# Altium project PC110.PrjPcb (part 4 of 5)

## Sheet Super_IO.SchDoc
size 420 x 297 mm
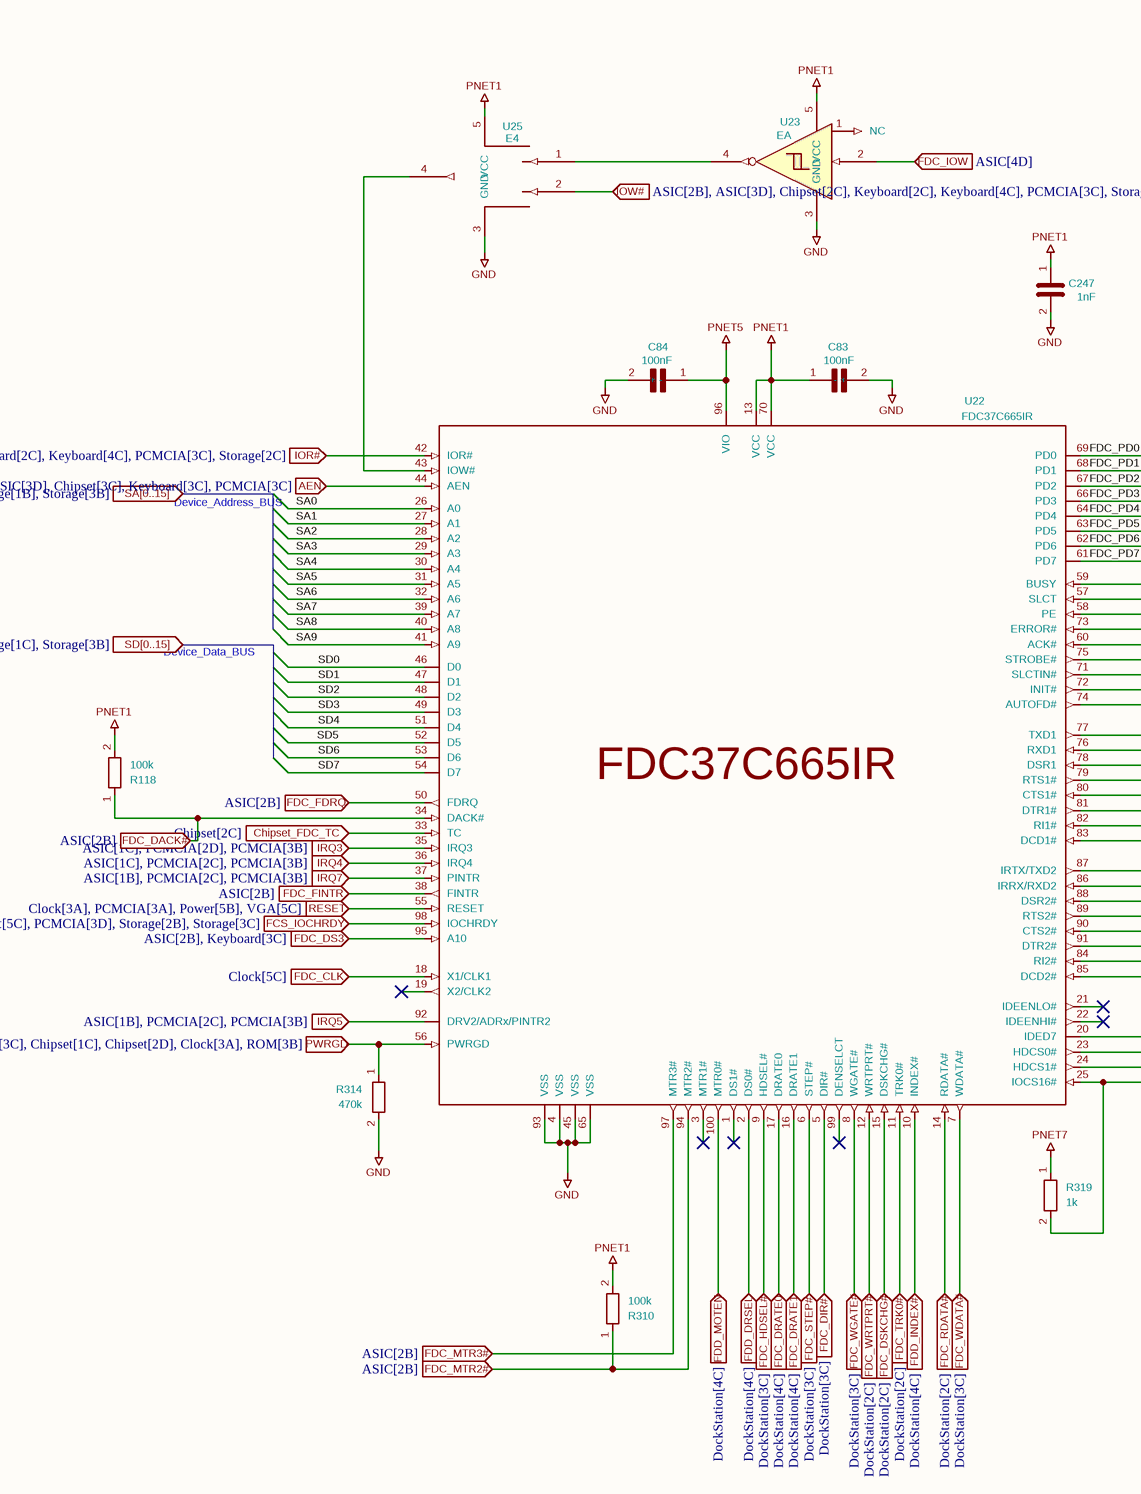
[diagram p32: Super_IO.SchDoc, left]
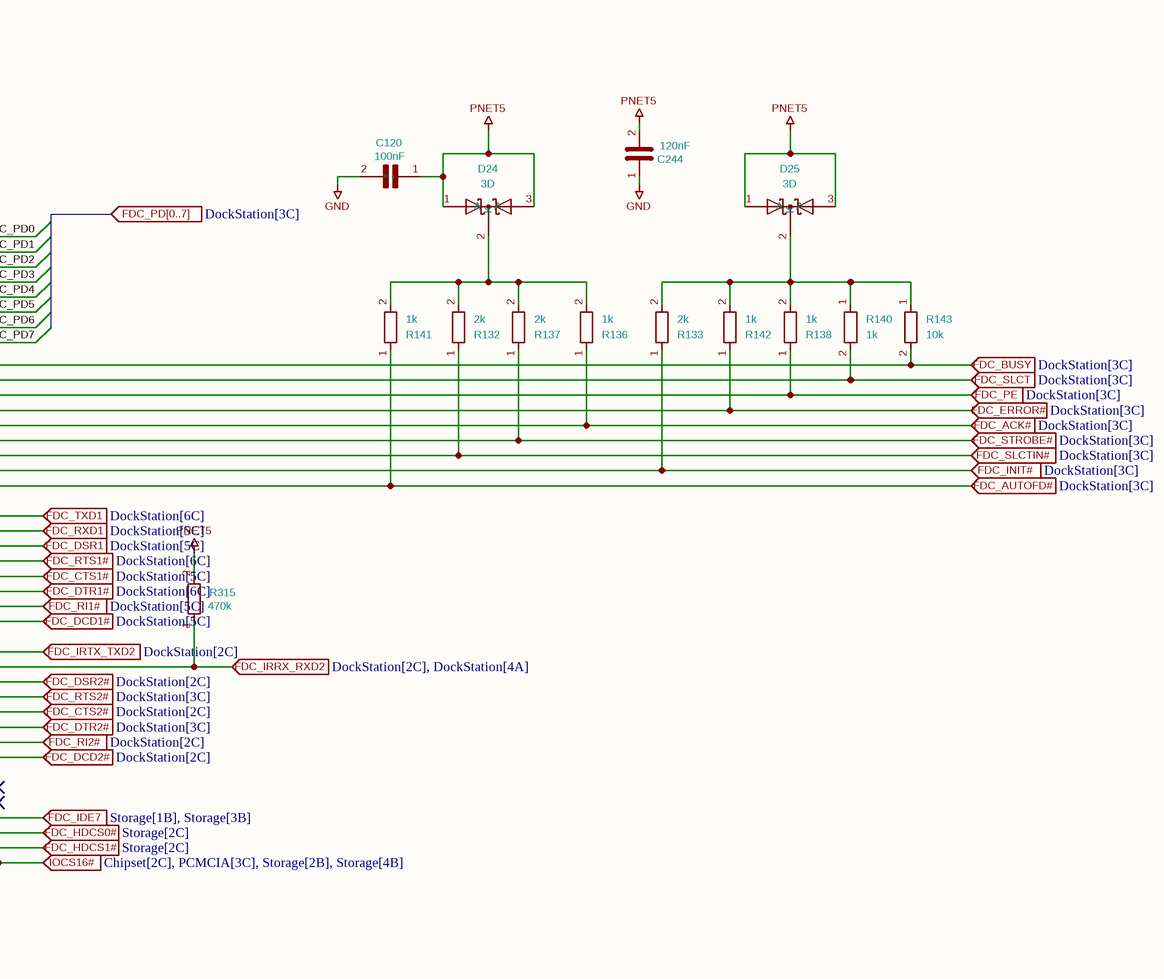
[diagram p33: Super_IO.SchDoc, right]

### Parts
C83  100nF  [C_0402_1005Metric]
C84  100nF  [C_0402_1005Metric]
C120  100nF  [C_0402_1005Metric]
C244  120nF  [C_0402_1005Metric]
C247  1nF  [C_0402_1005Metric]
D24  3D  [3D]
D25  3D  [3D]
R118  100k  [R_0402_1005Metric]
R132  2k  [R_0402_1005Metric]
R133  2k  [R_0402_1005Metric]
R136  1k  [R_0402_1005Metric]
R137  2k  [R_0402_1005Metric]
R138  1k  [R_0402_1005Metric]
R140  1k  [R_0402_1005Metric]
R141  1k  [R_0402_1005Metric]
R142  1k  [R_0402_1005Metric]
R143  10k  [R_0402_1005Metric]
R310  100k  [R_0402_1005Metric]
R314  470k  [R_0402_1005Metric]
R315  470k  [R_0402_1005Metric]
R319  1k  [R_0402_1005Metric]
U22  FDC37C665IR  [FDC]
U23  EA  [SOT-353]
U25  E4  [SOT-353]

### Ports
AEN (in, see ASIC[2B], ASIC[3D], Chipset[3C], Keyboard[3C], PCMCIA[3C]), Chipset_FDC_TC (in, see Chipset[2C]), FCS_IOCHRDY (in, see Chipset[5C], PCMCIA[3D], Storage[2B], Storage[3C]), FDC_ACK# (in, see DockStation[3C]), FDC_AUTOFD# (in, see DockStation[3C]), FDC_BUSY (in, see DockStation[3C]), FDC_CLK (in, see Clock[5C]), FDC_CTS1# (in, see DockStation[5C]), FDC_CTS2# (in, see DockStation[2C]), FDC_DACK# (in, see ASIC[2B]), FDC_DCD1# (in, see DockStation[5C]), FDC_DCD2# (in, see DockStation[2C]), FDC_DIR# (in, see DockStation[3C]), FDC_DRATE0 (in, see DockStation[4C]), FDC_DRATE1 (in, see DockStation[4C]), FDC_DS3 (in, see ASIC[2B], Keyboard[3C]), FDC_DSKCHG# (in, see DockStation[2C]), FDC_DSR1 (in, see DockStation[5C]), FDC_DSR2# (in, see DockStation[2C]), FDC_DTR1# (in, see DockStation[6C]), FDC_DTR2# (in, see DockStation[3C]), FDC_ERROR# (in, see DockStation[3C]), FDC_FDRQ (in, see ASIC[2B]), FDC_FINTR (in, see ASIC[2B]), FDC_HDCS0# (in, see Storage[2C]), FDC_HDCS1# (in, see Storage[2C]), FDC_HDSEL# (in, see DockStation[3C]), FDC_IDE7 (in, see Storage[1B], Storage[3B]), FDC_INIT# (in, see DockStation[3C]), FDC_IOW (in, see ASIC[4D]), FDC_IRRX_RXD2 (in, see DockStation[2C], DockStation[4A]), FDC_IRTX_TXD2 (in, see DockStation[2C]), FDC_MTR2# (in, see ASIC[2B]), FDC_MTR3# (in, see ASIC[2B]), FDC_PD[0..7] (in, see DockStation[3C]), FDC_PE (in, see DockStation[3C]), FDC_RDATA# (in, see DockStation[2C]), FDC_RI1# (in, see DockStation[5C]), FDC_RI2# (in, see DockStation[2C]), FDC_RTS1# (in, see DockStation[6C]), FDC_RTS2# (in, see DockStation[3C]), FDC_RXD1 (in, see DockStation[5C]), FDC_SLCT (in, see DockStation[3C]), FDC_SLCTIN# (in, see DockStation[3C]), FDC_STEP# (in, see DockStation[3C]), FDC_STROBE# (in, see DockStation[3C]), FDC_TRK0# (in, see DockStation[2C]), FDC_TXD1 (in, see DockStation[6C]), FDC_WDATA# (in, see DockStation[3C]), FDC_WGATE# (in, see DockStation[3C]), FDC_WRTPRT# (in, see DockStation[2C]), FDD_DRSEL (in, see DockStation[4C]), FDD_INDEX# (in, see DockStation[4C]), FDD_MOTEN (in, see DockStation[4C]), IOCS16# (in, see Chipset[2C], PCMCIA[3C], Storage[2B], Storage[4B]), IOR# (in, see ASIC[2B], ASIC[3D], Audio[3C], Audio[4C], Chipset[2C], Keyboard[2C], Keyboard[4C], PCMCIA[3C], Storage[2C]), IOW# (in, see ASIC[2B], ASIC[3D], Chipset[2C], Keyboard[2C], Keyboard[4C], PCMCIA[3C], Storage[2C]), IRQ3 (in, see ASIC[1C], PCMCIA[2D], PCMCIA[3B]), IRQ4 (in, see ASIC[1C], PCMCIA[2C], PCMCIA[3B]), IRQ5 (in, see ASIC[1B], PCMCIA[2C], PCMCIA[3B]), IRQ7 (in, see ASIC[1B], PCMCIA[2C], PCMCIA[3B]), PWRGD (in, see ASIC[2B], ASIC[3B], ASIC[3C], Chipset[1C], Chipset[2D], Clock[3A], ROM[3B]), RESET (in, see Clock[3A], PCMCIA[3A], Power[5B], VGA[5C]), SA[0..15] (in, see ASIC[1B], ASIC[3D], Audio[4B], Chipset[2D], Chipset[6B], Keyboard[1C], PCMCIA[2B], ROM[1B], ROM[3B], Storage[1B], Storage[3B]), SD[0..15] (in, see ASIC[1B], ASIC[3C], Audio[3B], Chipset[2B], Keyboard[1C], PCMCIA[2C], ROM[3B], ROM[5C], Storage[1B], Storage[1C], Storage[3B])

### Nets
GND: C83.2(-) C84.2(-) C120.2(-) C244.1 C247.2 R314.2 U22.4(VSS) U22.45(VSS) U22.65(VSS) U22.93(VSS) U23.3(GND) U25.3(GND)
PNET1: C83.1(+) C247.1 R118.2 R310.2 U22.13(VCC) U22.70(VCC) U23.5(VCC) U25.5(VCC)
PNET5: C84.1(+) C120.1(+) C244.2 D24.1(A) D24.3(A) D25.1(A) D25.3(A) R315.2 U22.96(VIO)
PNET7: R319.1
AEN: U22.44(AEN) ; port AEN
Chipset_FDC_TC: U22.33(TC) ; port Chipset_FDC_TC
FCS_IOCHRDY: U22.98(IOCHRDY) ; port FCS_IOCHRDY
FDC_ACK#: R136.1 U22.60(ACK#) ; port FDC_ACK#
FDC_AUTOFD#: R141.1 U22.74(AUTOFD#) ; port FDC_AUTOFD#
FDC_BUSY: R143.2 U22.59(BUSY) ; port FDC_BUSY
FDC_CLK: U22.18(X1/CLK1) ; port FDC_CLK
FDC_CTS1#: U22.80(CTS1#) ; port FDC_CTS1#
FDC_CTS2#: U22.90(CTS2#) ; port FDC_CTS2#
FDC_DACK#: R118.1 U22.34(DACK#) ; port FDC_DACK#
FDC_DCD1#: U22.83(DCD1#) ; port FDC_DCD1#
FDC_DCD2#: U22.85(DCD2#) ; port FDC_DCD2#
FDC_DIR#: U22.5(DIR#) ; port FDC_DIR#
FDC_DRATE0: U22.17(DRATE0) ; port FDC_DRATE0
FDC_DRATE1: U22.16(DRATE1) ; port FDC_DRATE1
FDC_DS3: U22.95(A10) ; port FDC_DS3
FDC_DSKCHG#: U22.15(DSKCHG#) ; port FDC_DSKCHG#
FDC_DSR1: U22.78(DSR1) ; port FDC_DSR1
FDC_DSR2#: U22.88(DSR2#) ; port FDC_DSR2#
FDC_DTR1#: U22.81(DTR1#) ; port FDC_DTR1#
FDC_DTR2#: U22.91(DTR2#) ; port FDC_DTR2#
FDC_ERROR#: R142.1 U22.73(ERROR#) ; port FDC_ERROR#
FDC_FDRQ: U22.50(FDRQ) ; port FDC_FDRQ
FDC_FINTR: U22.38(FINTR) ; port FDC_FINTR
FDC_HDCS0#: U22.23(HDCS0#) ; port FDC_HDCS0#
FDC_HDCS1#: U22.24(HDCS1#) ; port FDC_HDCS1#
FDC_HDSEL#: U22.9(HDSEL#) ; port FDC_HDSEL#
FDC_IDE7: U22.20(IDED7) ; port FDC_IDE7
FDC_INIT#: R133.1 U22.72(INIT#) ; port FDC_INIT#
FDC_IOW: U23.2 ; port FDC_IOW
FDC_IRRX_RXD2: R315.1 U22.86(IRRX/RXD2) ; port FDC_IRRX_RXD2
FDC_IRTX_TXD2: U22.87(IRTX/TXD2) ; port FDC_IRTX_TXD2
FDC_MTR2#: R310.1 U22.94(MTR2#) ; port FDC_MTR2#
FDC_MTR3#: U22.97(MTR3#) ; port FDC_MTR3#
FDC_PD0: U22.69(PD0)
FDC_PD1: U22.68(PD1)
FDC_PD2: U22.67(PD2)
FDC_PD3: U22.66(PD3)
FDC_PD4: U22.64(PD4)
FDC_PD5: U22.63(PD5)
FDC_PD6: U22.62(PD6)
FDC_PD7: U22.61(PD7)
FDC_PE: R138.1 U22.58(PE) ; port FDC_PE
FDC_RDATA#: U22.14(RDATA#) ; port FDC_RDATA#
FDC_RI1#: U22.82(RI1#) ; port FDC_RI1#
FDC_RI2#: U22.84(RI2#) ; port FDC_RI2#
FDC_RTS1#: U22.79(RTS1#) ; port FDC_RTS1#
FDC_RTS2#: U22.89(RTS2#) ; port FDC_RTS2#
FDC_RXD1: U22.76(RXD1) ; port FDC_RXD1
FDC_SLCT: R140.2 U22.57(SLCT) ; port FDC_SLCT
FDC_SLCTIN#: R132.1 U22.71(SLCTIN#) ; port FDC_SLCTIN#
FDC_STEP#: U22.6(STEP#) ; port FDC_STEP#
FDC_STROBE#: R137.1 U22.75(STROBE#) ; port FDC_STROBE#
FDC_TRK0#: U22.11(TRK0#) ; port FDC_TRK0#
FDC_TXD1: U22.77(TXD1) ; port FDC_TXD1
FDC_WDATA#: U22.7(WDATA#) ; port FDC_WDATA#
FDC_WGATE#: U22.8(WGATE#) ; port FDC_WGATE#
FDC_WRTPRT#: U22.12(WRTPRT#) ; port FDC_WRTPRT#
FDD_DRSEL: U22.2(DS0#) ; port FDD_DRSEL
FDD_INDEX#: U22.10(INDEX#) ; port FDD_INDEX#
FDD_MOTEN: U22.100(MTR0#) ; port FDD_MOTEN
IOCS16#: R319.2 U22.25(IOCS16#) ; port IOCS16#
IOR#: U22.42(IOR#) ; port IOR#
IOW#: U25.2 ; port IOW#
IRQ3: U22.35(IRQ3) ; port IRQ3
IRQ4: U22.36(IRQ4) ; port IRQ4
IRQ5: U22.92(DRV2/ADRx/PINTR2) ; port IRQ5
IRQ7: U22.37(PINTR) ; port IRQ7
PWRGD: R314.1 U22.56(PWRGD) ; port PWRGD
RESET: U22.55(RESET) ; port RESET
SA0: U22.26(A0)
SA1: U22.27(A1)
SA2: U22.28(A2)
SA3: U22.29(A3)
SA4: U22.30(A4)
SA5: U22.31(A5)
SA6: U22.32(A6)
SA7: U22.39(A7)
SA8: U22.40(A8)
SA9: U22.41(A9)
SD0: U22.46(D0)
SD1: U22.47(D1)
SD2: U22.48(D2)
SD3: U22.49(D3)
SD4: U22.51(D4)
SD5: U22.52(D5)
SD6: U22.53(D6)
SD7: U22.54(D7)
NetD24_2: D24.2(K) R132.2 R136.2 R137.2 R141.2
NetD25_2: D25.2(K) R133.2 R138.2 R140.1 R142.2 R143.1
NetU22_43: U22.43(IOW#) U25.4
NetU23_4: U23.4 U25.1

Not connected (* = marked no-connect by the designer): U22 1(DS1#)* 3(MTR1#)* 19(X2/CLK2)* 21(IDEENLO#)* 22(IDEENHI#)* 99(DENSELCT)*; U23 1(NC)

### Notes on the sheet
- Device_Address_BUS
- Device_Data_BUS
- 1
- 2
- 3
- 4
- 5
- 6
- 7
- 8
- A
- B
- C
- D
- E
- Title: PC110
- File: Super_IO.kicad_sch
- Sheet: /
- Recreated by: Ahmad Byagowi
- F
- KiCad E.D.A.  kicad (5.1.4)-1
- Size: A3
- Date:
- Rev:
- Id: 1/1

### Library data of the parts
C83 C84 C120 C244 C247 = C: Footprint: Capacitor_SMD:C_0402_1005Metric
  C83 C84 C120: Value: 100nF
  C244: Value: 120nF
  C247: Value: 1nF
D24 D25 = D_Schottky_Dual_CommonCathode_AKA: Value: 3D; Footprint: PC110:3D
R118 R132 R133 R136-R138 R140-R143 R310 R314 R315 R319 = R
  R118: Value: 100k; Footprint: PCM_Resistor_SMD_AKL:R_0402_1005Metric
  R132 R133 R137: Value: 2k; Footprint: PCM_Resistor_SMD_AKL:R_0402_1005Metric
  R136 R138 R140-R142 R319: Value: 1k; Footprint: PCM_Resistor_SMD_AKL:R_0402_1005Metric
  R143: Value: 10k; Footprint: PCM_Resistor_SMD_AKL:R_0402_1005Metric
  R310: Value: 100k; Footprint: Resistor_SMD:R_0402_1005Metric
  R314: Value: 470k; Footprint: PCM_Resistor_SMD_AKL:R_0402_1005Metric
  R315: Value: 470k; Footprint: Resistor_SMD:R_0402_1005Metric
U23 = 74AHC1G14: Value: EA; Footprint: PC110:SOT-353
U25 = 74AHC1G32: Value: E4; Footprint: PC110:SOT-353
U22 = FDC37C665IR: Value: FDC37C665IR; Footprint: PC110:FDC

## Sheet Storage.SchDoc
size 594 x 420 mm
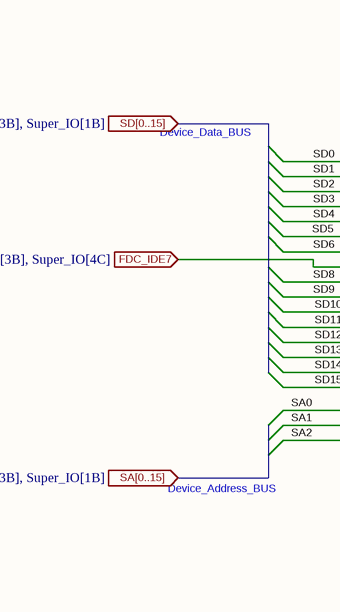
[diagram p34: Storage.SchDoc, top left]
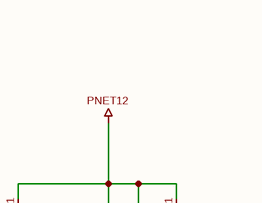
[diagram p35: Storage.SchDoc, top middle]
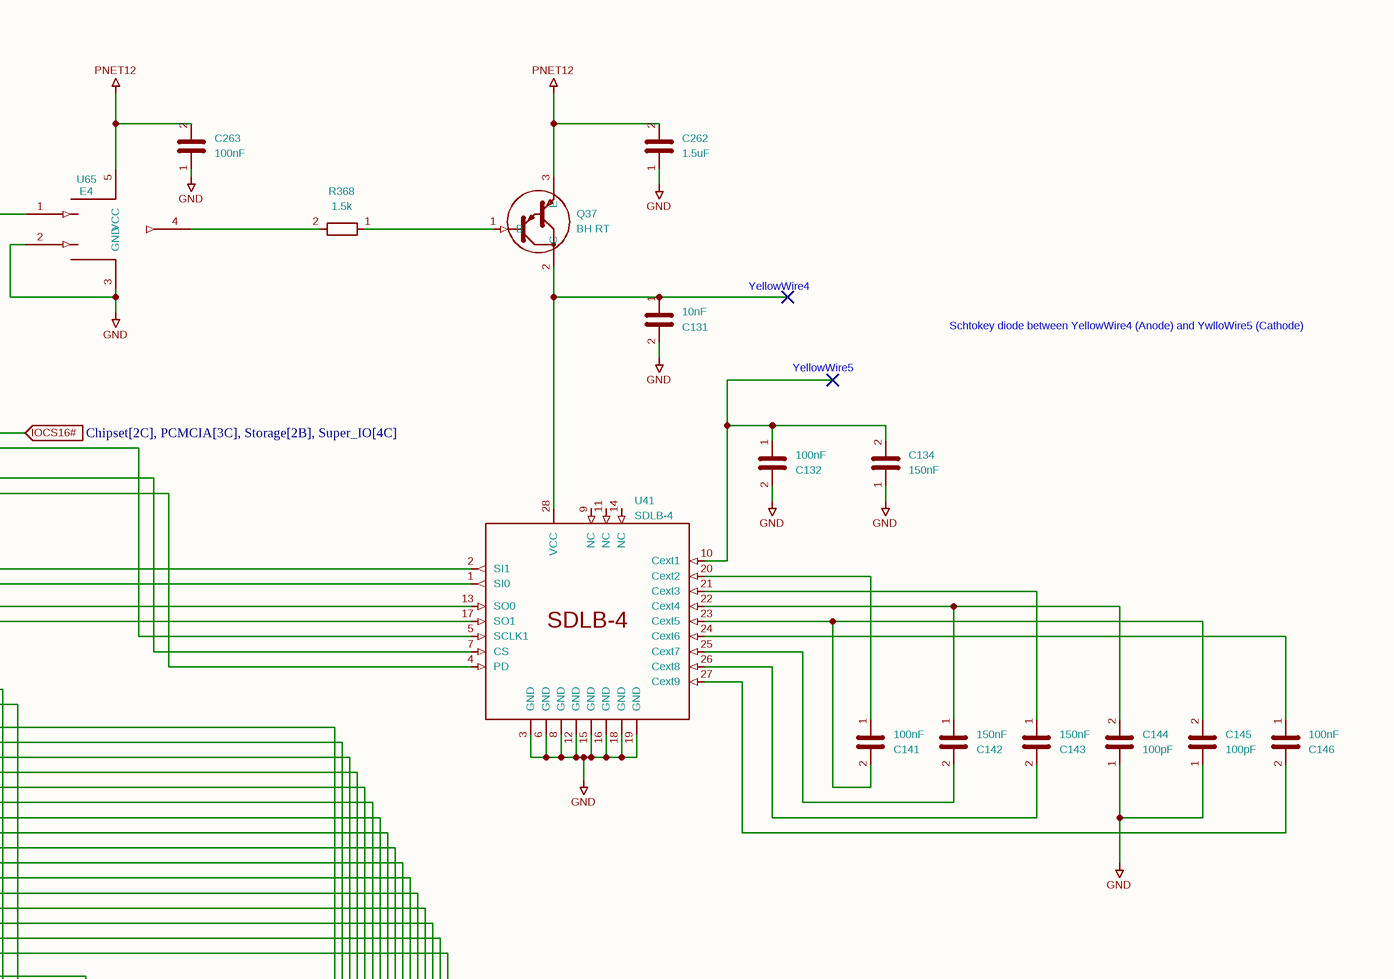
[diagram p36: Storage.SchDoc, top right]
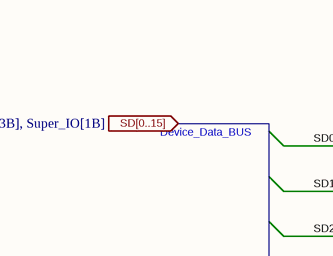
[diagram p37: Storage.SchDoc, bottom left]
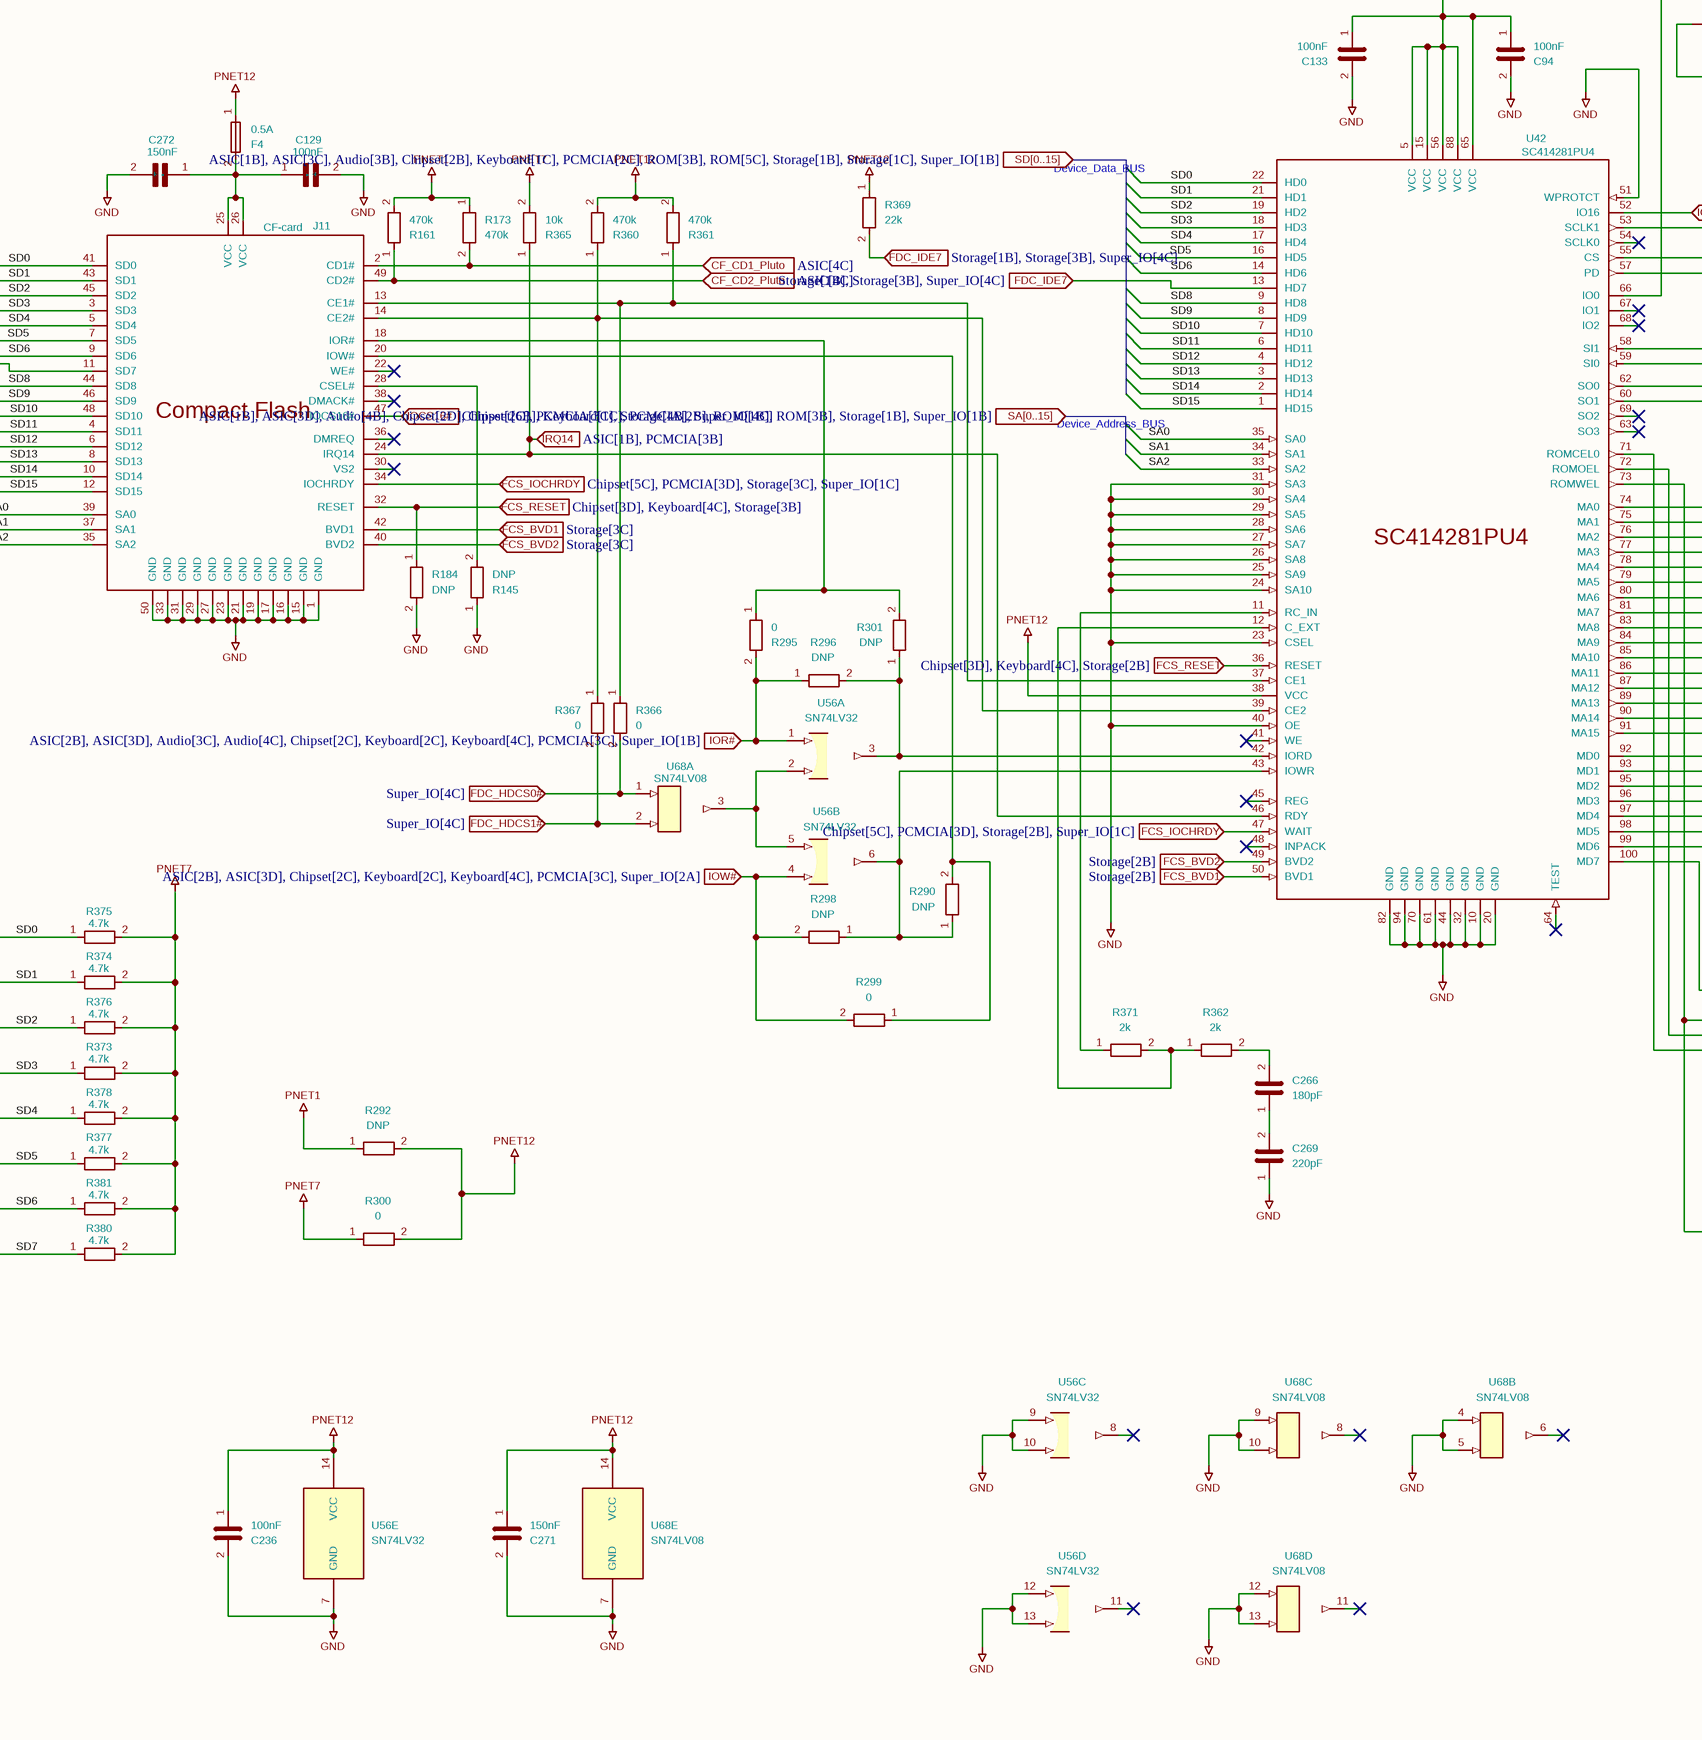
[diagram p38: Storage.SchDoc, bottom middle]
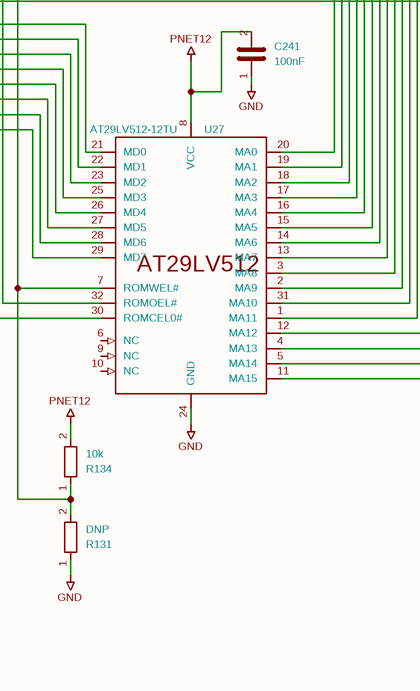
[diagram p39: Storage.SchDoc, bottom right]

### Parts
C94  100nF  [C_0402_1005Metric]
C129  100nF  [C_0402_1005Metric]
C131  10nF  [C_0603_1608Metric]
C132  100nF  [C_0603_1608Metric]
C133  100nF  [C_0402_1005Metric]
C134  150nF  [C_0603_1608Metric]
C141  100nF  [C_0402_1005Metric]
C142  150nF  [C_0402_1005Metric]
C143  150nF  [C_0402_1005Metric]
C144  100pF  [C_0402_1005Metric]
C145  100pF  [C_0402_1005Metric]
C146  100nF  [C_0402_1005Metric]
C236  100nF  [C_0402_1005Metric]
C241  100nF  [C_0402_1005Metric]
C262  1.5uF  [C_0805_2012Metric]
C263  100nF  [C_0402_1005Metric]
C266  180pF  [C_0402_1005Metric]
C269  220pF  [C_0402_1005Metric]
C271  150nF  [C_0402_1005Metric]
C272  150nF  [C_0402_1005Metric]
F4  0.5A  [Fuse_1206_3216Metric]
J11  CF-card  [CF-card]
Q37  BH RT  [SOT-89-3]
R131  DNP  [R_0402_1005Metric]
R134  10k  [R_0402_1005Metric]
R145  DNP  [R_0402_1005Metric]
R161  470k  [R_0402_1005Metric]
R173  470k  [R_0402_1005Metric]
R184  DNP  [R_0402_1005Metric]
R290  DNP  [R_0402_1005Metric]
R292  DNP  [R_0805_2012Metric]
R295  0  [R_0402_1005Metric]
R296  DNP  [R_0402_1005Metric]
R298  DNP  [R_0402_1005Metric]
R299  0  [R_0402_1005Metric]
R300  0  [R_0805_2012Metric]
R301  DNP  [R_0402_1005Metric]
R360  470k  [R_0402_1005Metric]
R361  470k  [R_0402_1005Metric]
R362  2k  [R_0402_1005Metric]
R365  10k  [R_0402_1005Metric]
R366  0  [R_0402_1005Metric]
R367  0  [R_0402_1005Metric]
R368  1.5k  [R_0402_1005Metric]
R369  22k  [R_0402_1005Metric]
R371  2k  [R_0402_1005Metric]
R373  4.7k  [R_0402_1005Metric]
R374  4.7k  [R_0402_1005Metric]
R375  4.7k  [R_0402_1005Metric]
R376  4.7k  [R_0402_1005Metric]
R377  4.7k  [R_0402_1005Metric]
R378  4.7k  [R_0402_1005Metric]
R380  4.7k  [R_0402_1005Metric]
R381  4.7k  [R_0402_1005Metric]
U27  AT29LV512-12TU  [Flash-32]
U41  SDLB-4  [SanDisk]
U42  SC414281PU4  [QFN-100]
U56  SN74LV32  [TSSOP-14_4.4x5mm_P0.65mm]  (parts A,B,C,D,E of 5)
U65  E4  [SOT-353]
U68  SN74LV08  [TSSOP-14_4.4x5mm_P0.65mm]  (parts A,B,C,D,E of 5)

### Ports
CF_CD1_Pluto (in, see ASIC[4C]), CF_CD2_Pluto (in, see ASIC[4C]), FCS_BVD1 (in, see Storage[2B]), FCS_BVD1 (in, see Storage[3C]), FCS_BVD2 (in, see Storage[2B]), FCS_BVD2 (in, see Storage[3C]), FCS_IOCHRDY (in, see Chipset[5C], PCMCIA[3D], Storage[2B], Super_IO[1C]), FCS_IOCHRDY (in, see Chipset[5C], PCMCIA[3D], Storage[3C], Super_IO[1C]), FCS_RESET (in, see Chipset[3D], Keyboard[4C], Storage[2B]), FCS_RESET (in, see Chipset[3D], Keyboard[4C], Storage[3B]), FDC_HDCS0# (in, see Super_IO[4C]), FDC_HDCS1# (in, see Super_IO[4C]), FDC_IDE7 (in, see Storage[1B], Storage[3B], Super_IO[4C]), FDC_IDE7 (in, see Storage[3B], Super_IO[4C]), IOCS16# (in, see Chipset[2C], PCMCIA[3C], Storage[2B], Super_IO[4C]), IOCS16# (in, see Chipset[2C], PCMCIA[3C], Storage[4B], Super_IO[4C]), IOR# (in, see ASIC[2B], ASIC[3D], Audio[3C], Audio[4C], Chipset[2C], Keyboard[2C], Keyboard[4C], PCMCIA[3C], Super_IO[1B]), IOW# (in, see ASIC[2B], ASIC[3D], Chipset[2C], Keyboard[2C], Keyboard[4C], PCMCIA[3C], Super_IO[2A]), IRQ14 (in, see ASIC[1B], PCMCIA[3B]), SA[0..15] (in, see ASIC[1B], ASIC[3D], Audio[4B], Chipset[2D], Chipset[6B], Keyboard[1C], PCMCIA[2B], ROM[1B], ROM[3B], Storage[1B], Super_IO[1B]), SA[0..15] (in, see ASIC[1B], ASIC[3D], Audio[4B], Chipset[2D], Chipset[6B], Keyboard[1C], PCMCIA[2B], ROM[1B], ROM[3B], Storage[3B], Super_IO[1B]), SD[0..15] (in, see ASIC[1B], ASIC[3C], Audio[3B], Chipset[2B], Keyboard[1C], PCMCIA[2C], ROM[3B], ROM[5C], Storage[1B], Storage[1C], Super_IO[1B]), SD[0..15] (in, see ASIC[1B], ASIC[3C], Audio[3B], Chipset[2B], Keyboard[1C], PCMCIA[2C], ROM[3B], ROM[5C], Storage[1B], Storage[3B], Super_IO[1B]), SD[0..15] (in, see ASIC[1B], ASIC[3C], Audio[3B], Chipset[2B], Keyboard[1C], PCMCIA[2C], ROM[3B], ROM[5C], Storage[1C], Storage[3B], Super_IO[1B])

### Nets
GND: C94.2 C129.2(-) C131.2 C132.2 C133.2 C134.1 C144.1 C145.1 C236.2 C241.1 C262.1 C263.1 C269.1 C271.2 C272.2(-) J11.1(GND) J11.15(GND) J11.16(GND) J11.17(GND) J11.19(GND) J11.21(GND) J11.23(GND) J11.27(GND) J11.29(GND) J11.31(GND) J11.33(GND) J11.50(GND) R131.1 R145.1 R184.2 U27.24(GND) U41.3(GND) U41.6(GND) U41.8(GND) U41.12(GND) U41.15(GND) U41.16(GND) U41.18(GND) U41.19(GND) U42.10(GND) U42.20(GND) U42.23(CSEL) U42.24(SA10) U42.25(SA9) U42.26(SA8) U42.27(SA7) U42.28(SA6) U42.29(SA5) U42.30(SA4) U42.31(SA3) U42.32(GND) U42.40(OE) U42.44(GND) U42.51(WPROTCT) U42.61(GND) U42.70(GND) U42.82(GND) U42.94(GND) U56.7(GND) U56.9 U56.10 U56.12 U56.13 U65.2 U65.3(GND) U68.4 U68.5 U68.7(GND) U68.9 U68.10 U68.12 U68.13
PNET1: R161.2 R173.1 R292.1
PNET7: R300.1 R365.2 R373.2 R374.2 R375.2 R376.2 R377.2 R378.2 R380.2 R381.2
PNET12: C94.1 C133.1 C236.1 C241.2 C262.2 C263.2 C271.1 F4.1 Q37.3(E) R134.2 R292.2 R300.2 R360.2 R361.2 R369.1 U27.8(VCC) U42.5(VCC) U42.15(VCC) U42.38(VCC) U42.56(VCC) U42.65(VCC) U42.88(VCC) U56.14(VCC) U65.5(VCC) U68.14(VCC)
CF_CD1_Pluto: J11.2(CD1#) R173.2 ; port CF_CD1_Pluto
CF_CD2_Pluto: J11.49(CD2#) R161.1 ; port CF_CD2_Pluto
FCS_BVD1: J11.42(BVD1) U42.50(BVD1) ; port FCS_BVD1
FCS_BVD2: J11.40(BVD2) U42.49(BVD2) ; port FCS_BVD2
FCS_IOCHRDY: J11.34(IOCHRDY) U42.47(WAIT) ; port FCS_IOCHRDY
FCS_RESET: J11.32(RESET) R184.1 U42.36(RESET) ; port FCS_RESET
FDC_HDCS0#: R366.2 U68.1 ; port FDC_HDCS0#
FDC_HDCS1#: R367.2 U68.2 ; port FDC_HDCS1#
FDC_IDE7: J11.11(SD7) R369.2 U42.13(HD7) ; port FDC_IDE7
IOCS16#: J11.47(IOCS16#) U42.52(IO16) ; port IOCS16#
IOR#: R295.2 R296.1 U56.1 ; port IOR#
IOW#: R298.2 R299.2 U56.4 ; port IOW#
IRQ14: J11.24(IRQ14) R365.1 U42.46(RDY) ; port IRQ14
SA0: J11.39(SA0) U42.35(SA0)
SA1: J11.37(SA1) U42.34(SA1)
SA2: J11.35(SA2) U42.33(SA2)
SD0: J11.41(SD0) R375.1 U42.22(HD0)
SD1: J11.43(SD1) R374.1 U42.21(HD1)
SD2: J11.45(SD2) R376.1 U42.19(HD2)
SD3: J11.3(SD3) R373.1 U42.18(HD3)
SD4: J11.5(SD4) R378.1 U42.17(HD4)
SD5: J11.7(SD5) R377.1 U42.16(HD5)
SD6: J11.9(SD6) R381.1 U42.14(HD6)
SD7: R380.1
SD8: J11.44(SD8) U42.9(HD8)
SD9: J11.46(SD9) U42.8(HD9)
SD10: J11.48(SD10) U42.7(HD10)
SD11: J11.4(SD11) U42.6(HD11)
SD12: J11.6(SD12) U42.4(HD12)
SD13: J11.8(SD13) U42.3(HD13)
SD14: J11.10(SD14) U42.2(HD14)
SD15: J11.12(SD15) U42.1(HD15)
NetC129_1: C129.1(+) C272.1(+) F4.2 J11.25(VCC) J11.26(VCC)
NetC131_1: C131.1 Q37.2(C) U41.28(VCC)
NetC132_1: C132.1 C134.2 U41.10(Cext1)
NetC141_1: C141.1 U41.20(Cext2)
NetC141_2: C141.2 C145.2 U41.23(Cext5)
NetC142_1: C142.1 C144.2 U41.22(Cext4)
NetC142_2: C142.2 U41.25(Cext7)
NetC143_1: C143.1 U41.21(Cext3)
NetC143_2: C143.2 U41.26(Cext8)
NetC146_1: C146.1 U41.24(Cext6)
NetC146_2: C146.2 U41.27(Cext9)
NetC266_1: C266.1 C269.2
NetC266_2: C266.2 R362.2
NetJ11_13: J11.13(CE1#) R361.1 R366.1 U42.37(CE1)
NetJ11_14: J11.14(CE2#) R360.1 R367.1 U42.39(CE2)
NetJ11_18: J11.18(IOR#) R295.1 R301.2
NetJ11_20: J11.20(IOW#) R290.2 R299.1
NetJ11_28: J11.28(CSEL#) R145.2
NetQ37_1: Q37.1(B) R368.1
NetR131_2: R131.2 R134.1 U27.7(ROMWEL#) U42.73(ROMWEL)
NetR290_1: R290.1 R298.1 U42.43(IOWR) U56.6
NetR296_2: R296.2 R301.1 U42.42(IORD) U56.3
NetR362_1: R362.1 R371.2 U42.12(C_EXT)
NetR368_2: R368.2 U65.4
NetR371_1: R371.1 U42.11(RC_IN)
NetU27_1: U27.1(MA11) U42.86(MA11)
NetU27_2: U27.2(MA9) U42.84(MA9)
NetU27_3: U27.3(MA8) U42.83(MA8)
NetU27_4: U27.4(MA13) U42.89(MA13)
NetU27_5: U27.5(MA14) U42.90(MA14)
NetU27_11: U27.11(MA15) U42.91(MA15)
NetU27_12: U27.12(MA12) U42.87(MA12)
NetU27_13: U27.13(MA7) U42.81(MA7)
NetU27_14: U27.14(MA6) U42.80(MA6)
NetU27_15: U27.15(MA5) U42.79(MA5)
NetU27_16: U27.16(MA4) U42.78(MA4)
NetU27_17: U27.17(MA3) U42.77(MA3)
NetU27_18: U27.18(MA2) U42.76(MA2)
NetU27_19: U27.19(MA1) U42.75(MA1)
NetU27_20: U27.20(MA0) U42.74(MA0)
NetU27_21: U27.21(MD0) U42.92(MD0)
NetU27_22: U27.22(MD1) U42.93(MD1)
NetU27_23: U27.23(MD2) U42.95(MD2)
NetU27_25: U27.25(MD3) U42.96(MD3)
NetU27_26: U27.26(MD4) U42.97(MD4)
NetU27_27: U27.27(MD5) U42.98(MD5)
NetU27_28: U27.28(MD6) U42.99(MD6)
NetU27_29: U27.29(MD7) U42.100(MD7)
NetU27_30: U27.30(ROMCEL0#) U42.71(ROMCEL0)
NetU27_31: U27.31(MA10) U42.85(MA10)
NetU27_32: U27.32(ROMOEL#) U42.72(ROMOEL)
NetU41_1: U41.1(SI0) U42.59(SI0)
NetU41_2: U41.2(SI1) U42.58(SI1)
NetU41_4: U41.4(PD) U42.57(PD)
NetU41_5: U41.5(SCLK1) U42.53(SCLK1)
NetU41_7: U41.7(CS) U42.55(CS)
NetU41_13: U41.13(SO0) U42.62(SO0)
NetU41_17: U41.17(SO1) U42.60(SO1)
NetU42_66: U42.66(IO0) U65.1
NetU56_2: U56.2 U56.5 U68.3

Not connected (* = marked no-connect by the designer): J11 22(WE#)* 30(VS2)* 36(DMREQ)* 38(DMACK#)*; U27 6(NC) 9(NC) 10(NC); U41 9(NC) 11(NC) 14(NC); U42 41(WE)* 45(REG)* 48(INPACK)* 54(SCLK0)* 63(SO3)* 64(TEST)* 67(IO1)* 68(IO2)* 69(SO2)*; U56 8* 11*; U68 6* 8* 11*

### Notes on the sheet
- YellowWire4
- Schtokey diode between YellowWire4 (Anode) and YwlloWire5 (Cathode)
- Device_Data_BUS
- YellowWire5
- Device_Address_BUS
- 1
- 2
- 3
- 4
- 5
- 6
- 7
- 8
- 9
- 10
- 11
- A
- B
- C
- D
- E
- F
- G
- H
- Title: PC110
- File: Storage.kicad_sch
- Sheet: /
- Recreated by: Ahmad Byagowi
- KiCad E.D.A.  kicad (5.1.4)-1
- Size: A2
- Date:
- Rev:
- Id: 1/1
- (in symbol CF_Conn) Compact Flash

### Library data of the parts
C94 C129 C131-C134 C141-C146 C236 C241 C262 C263 C266 C269 C271 C272 = C
  C94 C129 C133 C141 C146 C236 C241 C263: Value: 100nF; Footprint: Capacitor_SMD:C_0402_1005Metric
  C131: Value: 10nF; Footprint: Capacitor_SMD:C_0603_1608Metric
  C132: Value: 100nF; Footprint: Capacitor_SMD:C_0603_1608Metric
  C134: Value: 150nF; Footprint: Capacitor_SMD:C_0603_1608Metric
  C142 C143 C271 C272: Value: 150nF; Footprint: Capacitor_SMD:C_0402_1005Metric
  C144 C145: Value: 100pF; Footprint: Capacitor_SMD:C_0402_1005Metric
  C262: Value: 1.5uF; Footprint: Capacitor_SMD:C_0805_2012Metric
  C266: Value: 180pF; Footprint: Capacitor_SMD:C_0402_1005Metric
  C269: Value: 220pF; Footprint: Capacitor_SMD:C_0402_1005Metric
F4 = Fuse: Value: 0.5A; Footprint: Fuse:Fuse_1206_3216Metric
J11 = CF_Conn: Value: CF-card; Footprint: PC110:CF-card
Q37 = Q_PNP_Darlington_Generic_BCE: Value: BH RT; Footprint: Package_TO_SOT_SMD:SOT-89-3
R131 R134 R145 R161 R173 R184 R290 R292 R295 R296 R298-R301 R360-R362 R365-R369 R371 R373-R378 R380 R381 = R
  R131 R145 R184: Value: DNP; Footprint: PCM_Resistor_SMD_AKL:R_0402_1005Metric
  R134: Value: 10k; Footprint: PCM_Resistor_SMD_AKL:R_0402_1005Metric
  R161 R173: Value: 470k; Footprint: PCM_Resistor_SMD_AKL:R_0402_1005Metric
  R290 R296 R298 R301: Value: DNP; Footprint: Resistor_SMD:R_0402_1005Metric
  R292: Value: DNP; Footprint: Resistor_SMD:R_0805_2012Metric
  R295 R299 R366 R367: Value: 0; Footprint: Resistor_SMD:R_0402_1005Metric
  R300: Value: 0; Footprint: Resistor_SMD:R_0805_2012Metric
  R360 R361: Value: 470k; Footprint: Resistor_SMD:R_0402_1005Metric
  R362 R371: Value: 2k; Footprint: Resistor_SMD:R_0402_1005Metric
  R365: Value: 10k; Footprint: Resistor_SMD:R_0402_1005Metric
  R368: Value: 1.5k; Footprint: Resistor_SMD:R_0402_1005Metric
  R369: Value: 22k; Footprint: Resistor_SMD:R_0402_1005Metric
  R373-R378 R380 R381: Value: 4.7k; Footprint: Resistor_SMD:R_0402_1005Metric
U27 = AT29LV512: Value: AT29LV512-12TU; Footprint: PC110:Flash-32
U56 = 74LS32: Value: SN74LV32; Footprint: Package_SO:TSSOP-14_4.4x5mm_P0.65mm
U65 = 74AHC1G32: Value: E4; Footprint: PC110:SOT-353
U68 = 74LS08: Value: SN74LV08; Footprint: Package_SO:TSSOP-14_4.4x5mm_P0.65mm
U41 = SDLB-4: Value: SDLB-4; Footprint: PC110:SanDisk
U42 = SC414281PU4: Value: SC414281PU4; Footprint: PC110:QFN-100

## Sheet Audio.SchDoc
size 594 x 420 mm
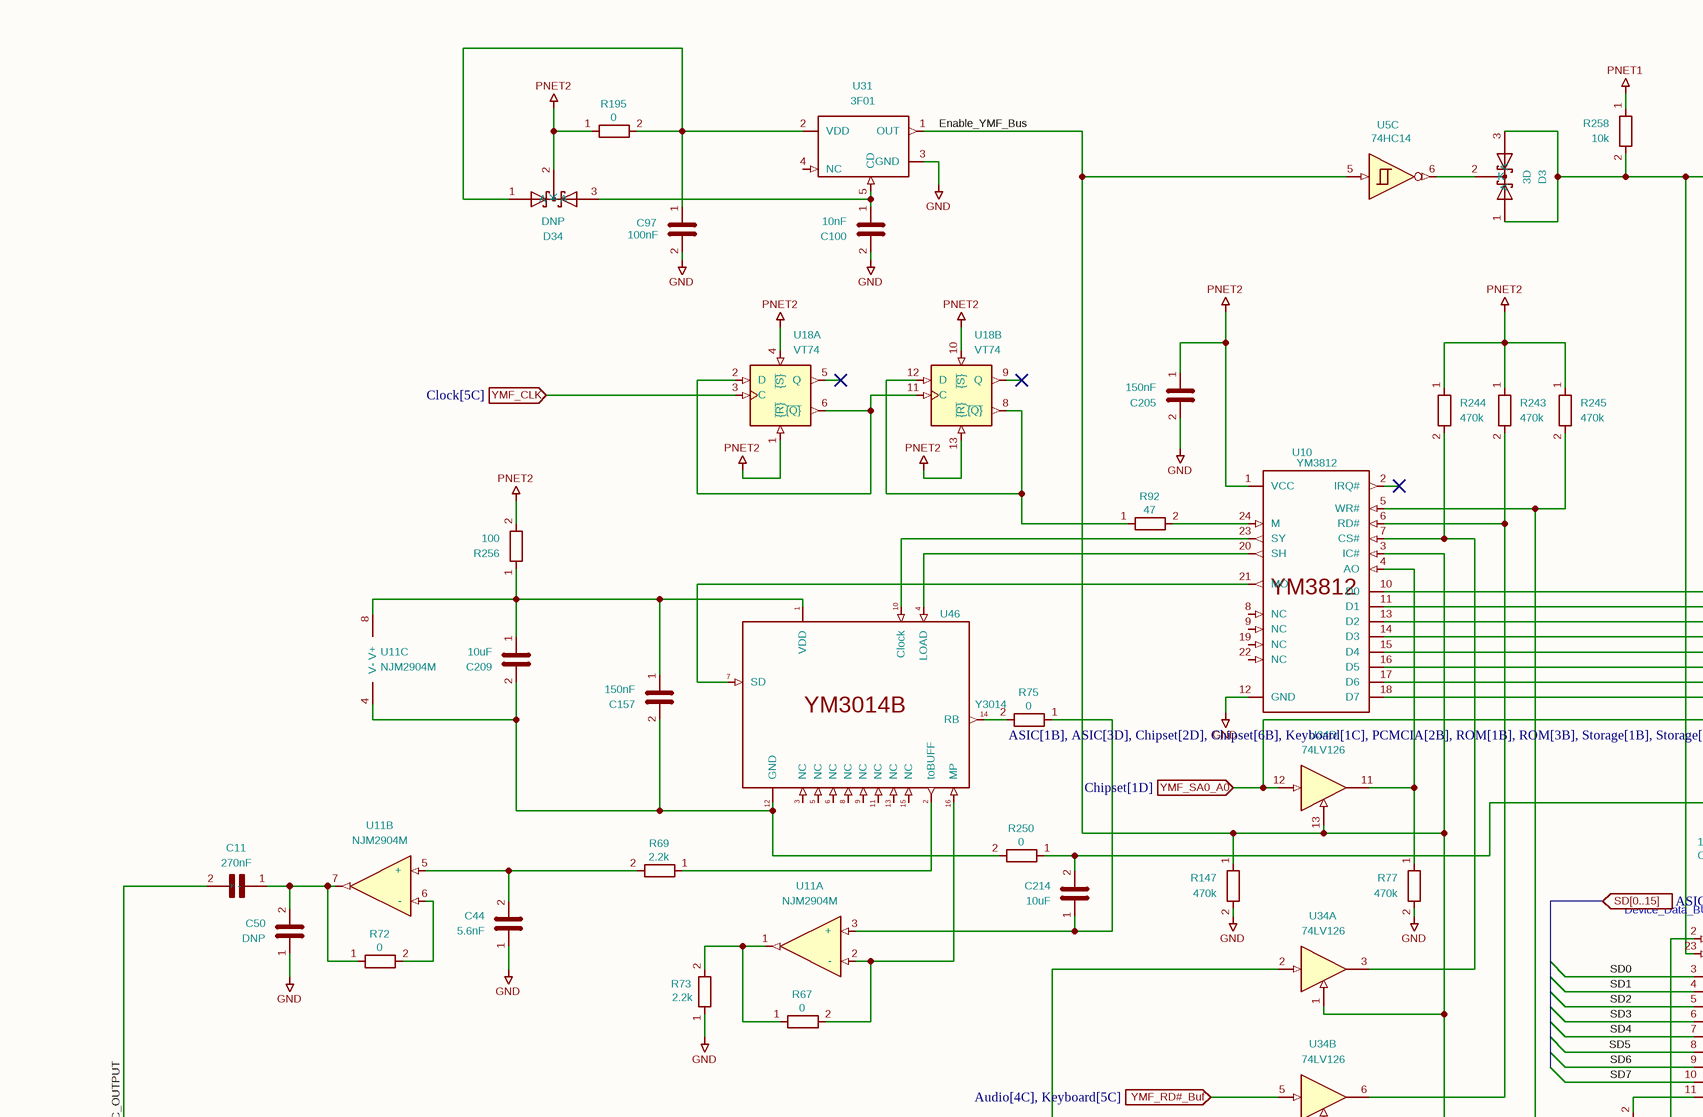
[diagram p40: Audio.SchDoc, top left]
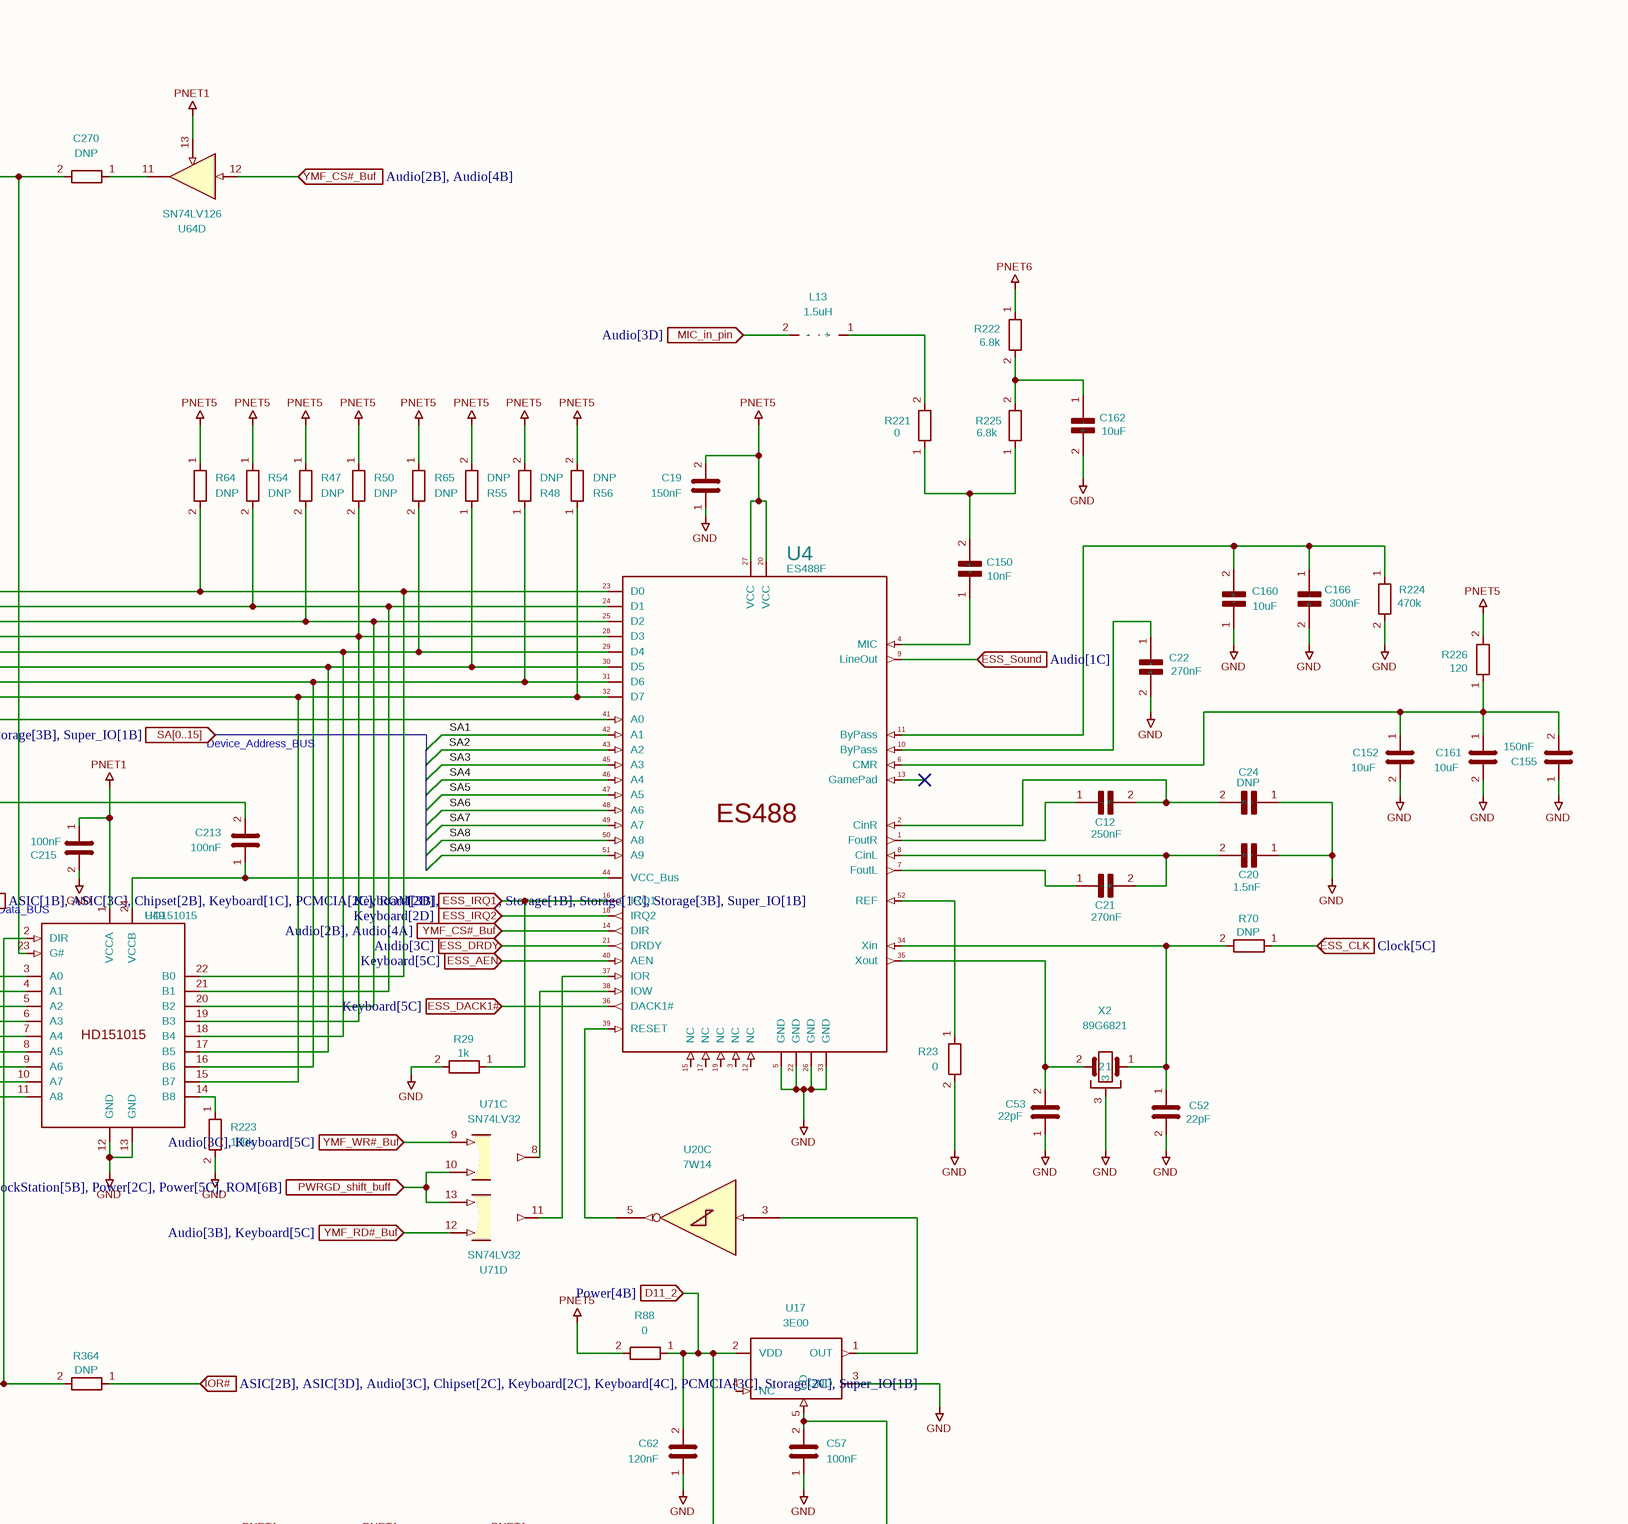
[diagram p41: Audio.SchDoc, top right]
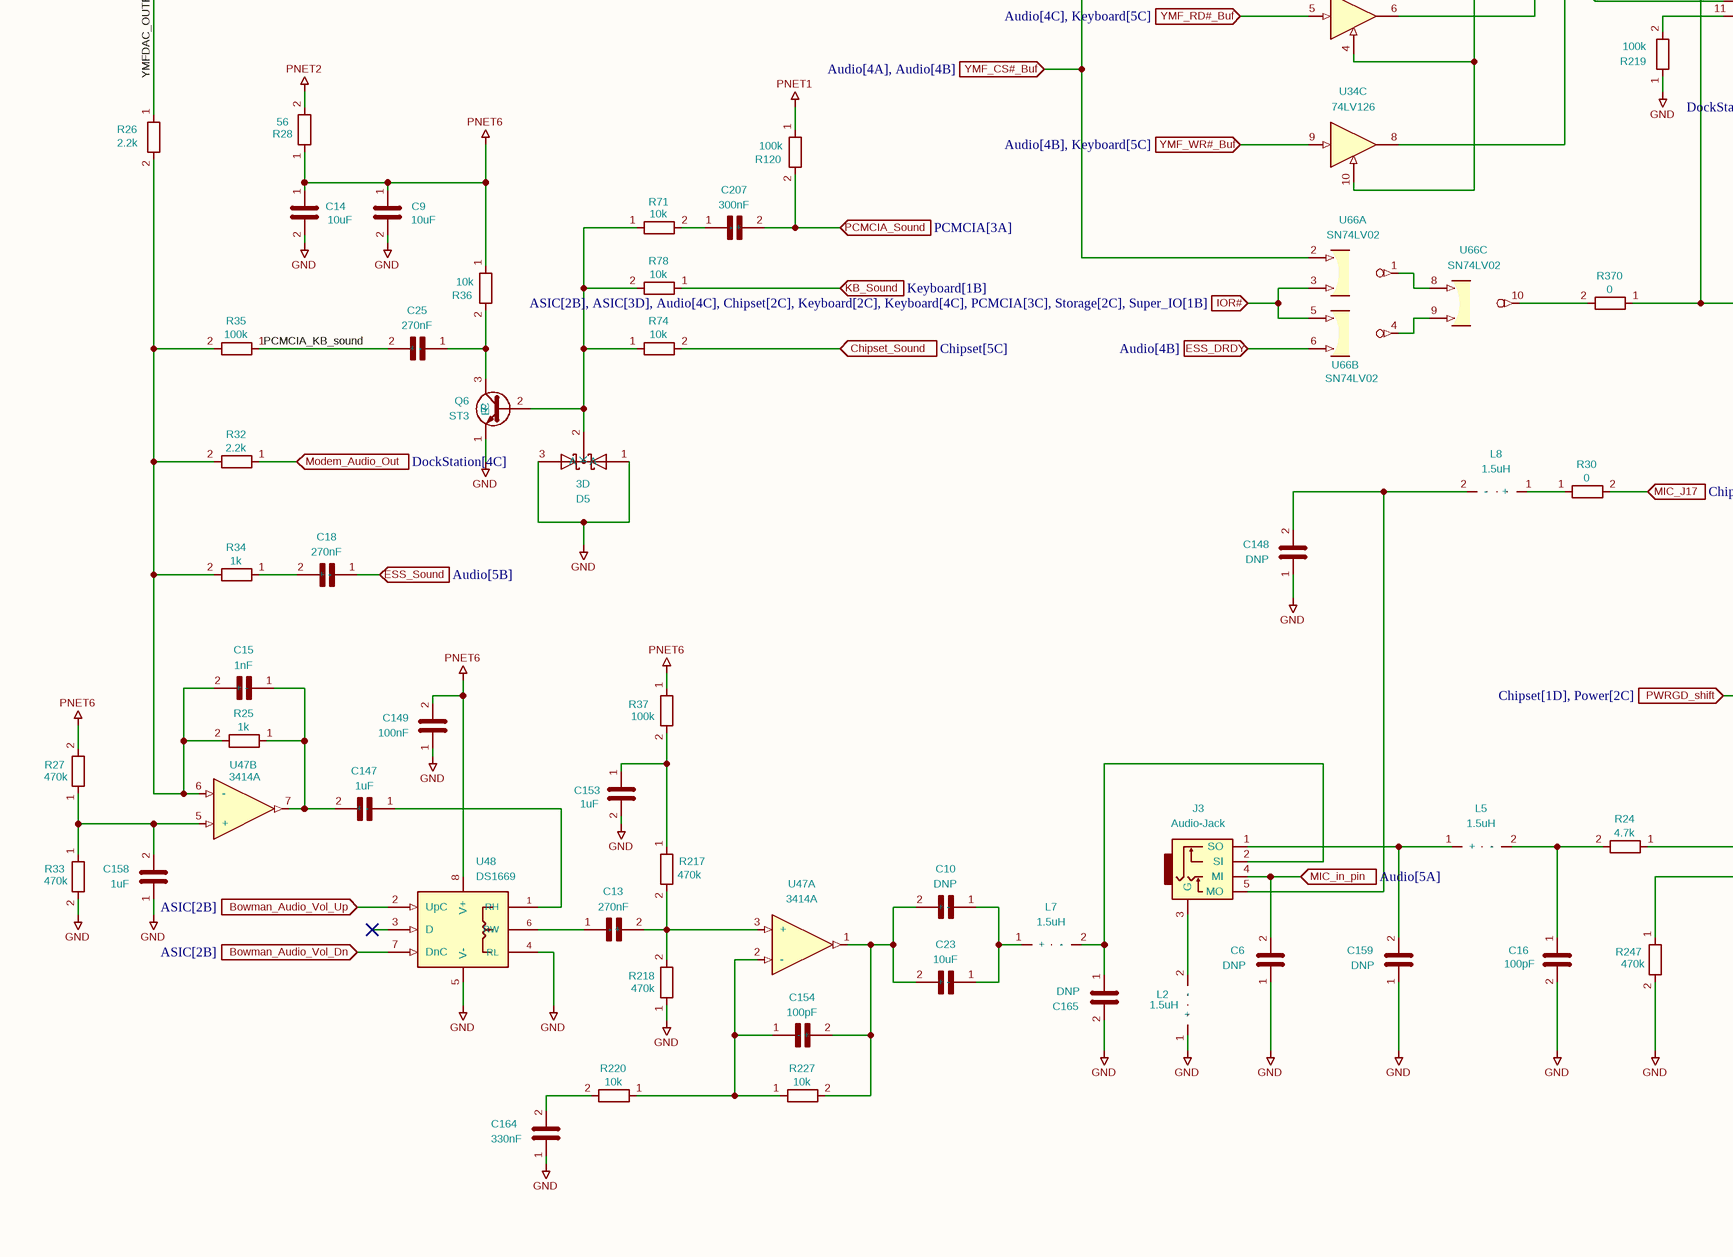
[diagram p42: Audio.SchDoc, bottom left]
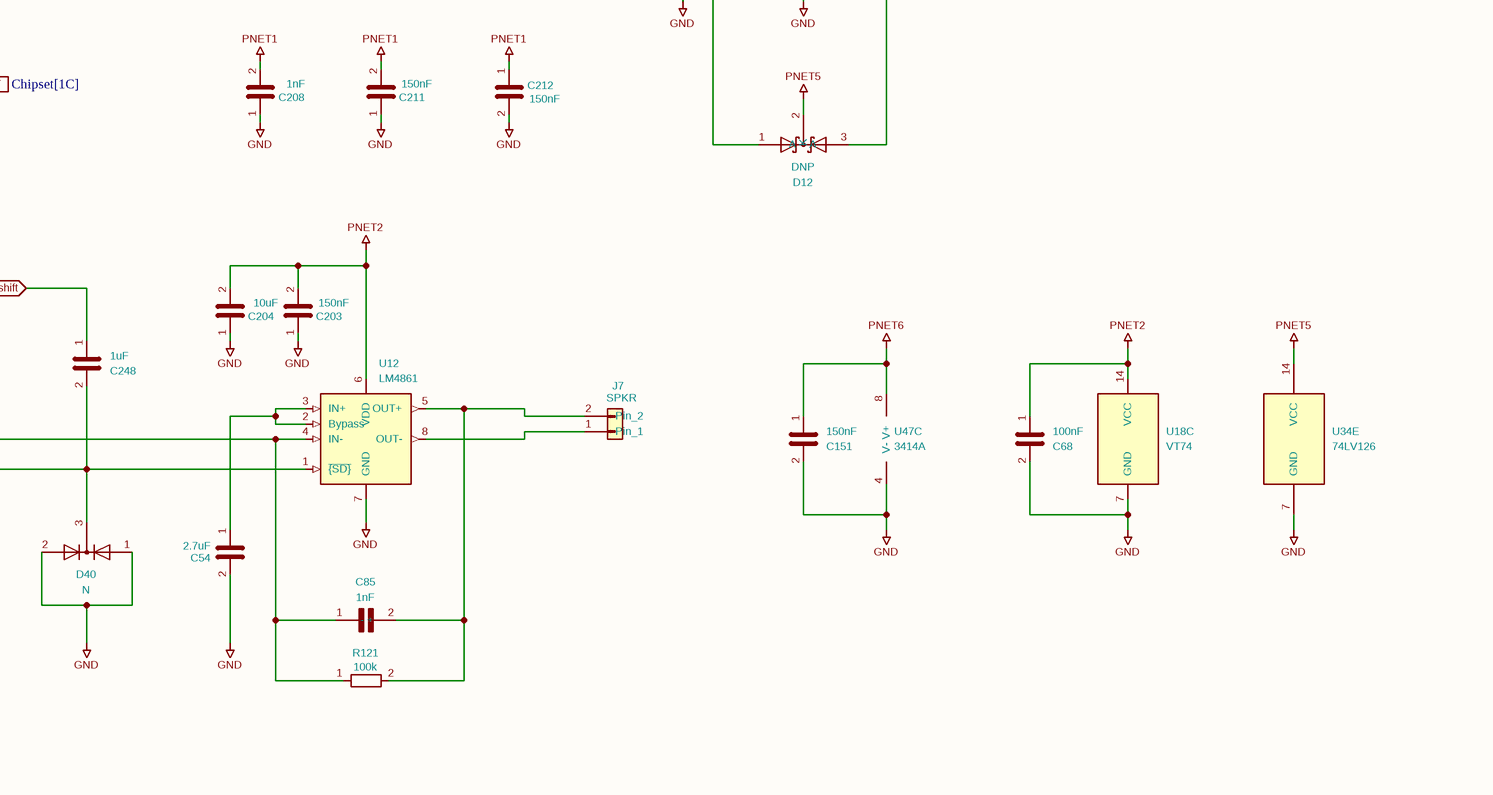
[diagram p43: Audio.SchDoc, bottom right]

### Parts
C6  DNP  [C_0402_1005Metric]
C9  10uF  [C_1206_3216Metric]
C10  DNP  [C_1206_3216Metric]
C11  270nF  [C_0603_1608Metric]
C12  250nF  [C_0603_1608Metric]
C13  270nF  [C_0603_1608Metric]
C14  10uF  [C_1206_3216Metric]
C15  1nF  [C_0402_1005Metric]
C16  100pF  [C_0402_1005Metric]
C18  270nF  [C_0603_1608Metric]
C19  150nF  [C_0402_1005Metric]
C20  1.5nF  [C_0402_1005Metric]
C21  270nF  [C_0603_1608Metric]
C22  270nF  [C_0603_1608Metric]
C23  10uF  [C_1206_3216Metric]
C24  DNP  [C_0402_1005Metric]
C25  270nF  [C_0603_1608Metric]
C44  5.6nF  [C_0402_1005Metric]
C50  DNP  [C_0402_1005Metric]
C52  22pF  [C_0402_1005Metric]
C53  22pF  [C_0402_1005Metric]
C54  2.7uF  [C_0805_2012Metric]
C57  100nF  [C_0603_1608Metric]
C62  120nF  [C_0402_1005Metric]
C68  100nF  [C_0402_1005Metric]
C85  1nF  [C_0402_1005Metric]
C97  100nF  [C_0402_1005Metric]
C100  10nF  [C_0603_1608Metric]
C147  1uF  [C_0603_1608Metric]
C148  DNP  [C_0402_1005Metric]
C149  100nF  [C_0402_1005Metric]
C150  10nF  [C_0603_1608Metric]
C151  150nF  [C_0402_1005Metric]
C152  10uF  [C_1206_3216Metric]
C153  1uF  [C_0603_1608Metric]
C154  100pF  [C_0402_1005Metric]
C155  150nF  [C_0402_1005Metric]
C157  150nF  [C_0402_1005Metric]
C158  1uF  [C_0603_1608Metric]
C159  DNP  [C_0402_1005Metric]
C160  10uF  [C_1206_3216Metric]
C161  10uF  [C_1206_3216Metric]
C162  10uF  [C_1206_3216Metric]
C164  330nF  [C_0603_1608Metric]
C165  DNP  [C_0402_1005Metric]
C166  300nF  [C_0603_1608Metric]
C203  150nF  [C_0402_1005Metric]
C204  10uF  [C_1206_3216Metric]
C205  150nF  [C_0402_1005Metric]
C207  300nF  [C_0603_1608Metric]
C208  1nF  [C_0402_1005Metric]
C209  10uF  [C_1206_3216Metric]
C211  150nF  [C_0402_1005Metric]
C212  150nF  [C_0402_1005Metric]
C213  100nF  [C_0402_1005Metric]
C214  10uF  [C_1206_3216Metric]
C215  100nF  [C_0402_1005Metric]
C248  1uF  [C_0603_1608Metric]
C270  DNP  [C_0402_1005Metric]
D3  3D  [3D]
D5  3D  [3D]
D12  DNP  [3D]
D34  DNP  [3D]
D40  N  [SOT-416L]
J3  Audio-Jack  [Audio-Jack]
J7  SPKR  [SPKR]
L2  1.5uH  [L_0603_1608Metric]
L5  1.5uH  [L_0603_1608Metric]
L7  1.5uH  [L_0603_1608Metric]
L8  1.5uH  [L_0603_1608Metric]
L13  1.5uH  [L_0603_1608Metric]
Q6  ST3  [SOT-416L]
R23  0  [R_0402_1005Metric]
R24  4.7k  [R_0402_1005Metric]
R25  1k  [R_0402_1005Metric]
R26  2.2k  [R_0402_1005Metric]
R27  470k  [R_0402_1005Metric]
R28  56  [R_1206_3216Metric]
R29  1k  [R_0402_1005Metric]
R30  0  [R_0402_1005Metric]
R32  2.2k  [R_0402_1005Metric]
R33  470k  [R_0402_1005Metric]
R34  1k  [R_0402_1005Metric]
R35  100k  [R_0402_1005Metric]
R36  10k  [R_0402_1005Metric]
R37  100k  [R_0402_1005Metric]
R47  DNP  [R_0402_1005Metric]
R48  DNP  [R_0402_1005Metric]
R50  DNP  [R_0402_1005Metric]
R54  DNP  [R_0402_1005Metric]
R55  DNP  [R_0402_1005Metric]
R56  DNP  [R_0402_1005Metric]
R64  DNP  [R_0402_1005Metric]
R65  DNP  [R_0402_1005Metric]
R67  0  [R_0402_1005Metric]
R69  2.2k  [R_0402_1005Metric]
R70  DNP  [R_0402_1005Metric]
R71  10k  [R_0402_1005Metric]
R72  0  [R_0402_1005Metric]
R73  2.2k  [R_0402_1005Metric]
R74  10k  [R_0402_1005Metric]
R75  0  [R_0402_1005Metric]
R77  470k  [R_0402_1005Metric]
R78  10k  [R_0402_1005Metric]
R88  0  [R_0402_1005Metric]
R92  47  [R_0402_1005Metric]
R120  100k  [R_0402_1005Metric]
R121  100k  [R_0402_1005Metric]
R147  470k  [R_0402_1005Metric]
R195  0  [R_0402_1005Metric]
R217  470k  [R_0402_1005Metric]
R218  470k  [R_0402_1005Metric]
R219  100k  [R_0402_1005Metric]
R220  10k  [R_0402_1005Metric]
R221  0  [R_0402_1005Metric]
R222  6.8k  [R_0402_1005Metric]
R223  100k  [R_0402_1005Metric]
R224  470k  [R_0402_1005Metric]
R225  6.8k  [R_0402_1005Metric]
R226  120  [R_1206_3216Metric]
R227  10k  [R_0402_1005Metric]
R243  470k  [R_0402_1005Metric]
R244  470k  [R_0402_1005Metric]
R245  470k  [R_0402_1005Metric]
R247  470k  [R_0402_1005Metric]
R250  0  [R_0805_2012Metric]
R256  100  [R_0805_2012Metric]
R258  10k  [R_0402_1005Metric]
R364  DNP  [R_0402_1005Metric]
R370  0  [R_0402_1005Metric]
U4  ES488F  [QFN-52]
U5  74HC14  [TSSOP-14_4.4x5mm_P0.65mm]  (part C of 7)
U10  YM3812  [SOP-24]
U11  NJM2904M  [soic-8-small]  (parts A,B,C of 3)
U12  LM4861  [SOIC-8-narrow]
U17  3E00  [SOT-23-5]
U18  VT74  [TSSOP-14_4.4x5mm_P0.65mm]  (parts A,B,C of 3)
U20  7W14  [sso-8]  (part C of 4)
U31  3F01  [SOT-23-5]
U34  74LV126  [TSSOP-14_4.4x5mm_P0.65mm]  (parts A,B,C,D,E of 5)
U46  Y3014  [SOP-16]
U47  3414A  [SOIC-8]  (parts A,B,C of 3)
U48  DS1669  [SOIC-8]
U49  HD151015  [SSOP-24_5.3x8.2mm_P0.65mm]
U64  SN74LV126  [TSSOP-14_4.4x5mm_P0.65mm]  (part D of 5)
U66  SN74LV02  [TSSOP-14_4.4x5mm_P0.65mm]  (parts A,B,C of 5)
U71  SN74LV32  [TSSOP-14_4.4x5mm_P0.65mm]  (parts C,D of 5)
X2  89G6821  [XTAL-1]

### Ports
Bowman_Audio_Vol_Dn (in, see ASIC[2B]), Bowman_Audio_Vol_Up (in, see ASIC[2B]), Chipset_Sound (in, see Chipset[5C]), D11_2 (in, see Power[4B]), ESS_AEN (in, see Keyboard[5C]), ESS_CLK (in, see Clock[5C]), ESS_DACK1# (in, see Keyboard[5C]), ESS_DRDY (in, see Audio[3C]), ESS_DRDY (in, see Audio[4B]), ESS_IRQ1 (in, see Keyboard[2D]), ESS_IRQ2 (in, see Keyboard[2D]), ESS_Sound (in, see Audio[1C]), ESS_Sound (in, see Audio[5B]), IOR# (in, see ASIC[2B], ASIC[3D], Audio[3C], Chipset[2C], Keyboard[2C], Keyboard[4C], PCMCIA[3C], Storage[2C], Super_IO[1B]), IOR# (in, see ASIC[2B], ASIC[3D], Audio[4C], Chipset[2C], Keyboard[2C], Keyboard[4C], PCMCIA[3C], Storage[2C], Super_IO[1B]), KB_Sound (in, see Keyboard[1B]), MIC_in_pin (in, see Audio[3D]), MIC_in_pin (in, see Audio[5A]), MIC_J17 (in, see Chipset[1C]), Modem_Audio_Out (in, see DockStation[4C]), PCMCIA_Sound (in, see PCMCIA[3A]), PWRGD_shift (in, see Chipset[1D], Power[2C]), PWRGD_shift_buff (in, see DockStation[5B], Power[2C], Power[5C], ROM[6B]), SA[0..15] (in, see ASIC[1B], ASIC[3D], Chipset[2D], Chipset[6B], Keyboard[1C], PCMCIA[2B], ROM[1B], ROM[3B], Storage[1B], Storage[3B], Super_IO[1B]), SD[0..15] (in, see ASIC[1B], ASIC[3C], Chipset[2B], Keyboard[1C], PCMCIA[2C], ROM[3B], ROM[5C], Storage[1B], Storage[1C], Storage[3B], Super_IO[1B]), YMF_CLK (in, see Clock[5C]), YMF_CS#_Buf (in, see Audio[2B], Audio[4A]), YMF_CS#_Buf (in, see Audio[2B], Audio[4B]), YMF_CS#_Buf (in, see Audio[4A], Audio[4B]), YMF_RD#_Buf (in, see Audio[3B], Keyboard[5C]), YMF_RD#_Buf (in, see Audio[4C], Keyboard[5C]), YMF_SA0_A0 (in, see Chipset[1D]), YMF_WR#_Buf (in, see Audio[3C], Keyboard[5C]), YMF_WR#_Buf (in, see Audio[4B], Keyboard[5C])

### Nets
GND: C6.1 C9.2 C14.2 C16.2 C19.1 C20.1(+) C22.2(-) C24.1(+) C44.1 C50.1 C52.2 C53.1 C54.2 C57.1 C62.1 C68.2 C97.2 C100.2 C148.1 C149.1 C151.2 C152.2 C153.2 C155.1 C158.1 C159.1 C160.1(+) C161.2 C162.2(-) C164.1 C165.2 C166.2(-) C203.1 C204.1 C205.2 C208.1 C211.1 C212.2 C215.2 D5.1(A) D5.3(A) D40.1 D40.2 L2.1(+) Q6.1(E) R23.2 R29.2 R33.2 R73.1 R77.2 R147.2 R218.1 R219.1 R223.2 R224.2 R247.2 U4.5(GND) U4.22(GND) U4.26(GND) U4.33(GND) U10.12(GND) U12.7(GND) U17.3(GND) U18.7(GND) U31.3(GND) U34.7(GND) U47.4(V-) U48.4(RL) U48.5(V-) U49.12(GND) U49.13(GND) X2.3
PNET1: C208.2 C211.2 C212.1 C215.1 R120.1 R258.1 U49.1(VCCA) U64.13
PNET2: C68.1 C203.2 C204.2 C205.1 D34.2(K) R28.2 R195.1 R243.1 R244.1 R245.1 R256.2 U10.1(VCC) U12.6(VDD) U18.1(~{{R}}) U18.4(~{{S}}) U18.10(~{{S}}) U18.13(~{{R}}) U18.14(VCC)
PNET5: C19.2 D12.2(K) R47.1 R48.2 R50.1 R54.1 R55.2 R56.2 R64.1 R65.1 R88.2 R226.2 U4.20(VCC) U4.27(VCC) U34.14(VCC)
PNET6: C9.1 C14.1 C149.2 C151.1 R27.2 R28.1 R36.1 R37.1 R222.1 U47.8(V+) U48.8(V+)
Bowman_Audio_Vol_Dn: U48.7(DnC) ; port Bowman_Audio_Vol_Dn
Bowman_Audio_Vol_Up: U48.2(UpC) ; port Bowman_Audio_Vol_Up
Chipset_Sound: R74.2 ; port Chipset_Sound
D11_2: C62.2 D12.1(A) R88.1 U17.2(VDD) ; port D11_2
Enable_YMF_Bus: R147.1 U5.5 U10.3(IC#) U31.1(OUT) U34.1 U34.4 U34.10 U34.13
ESS_AEN: U4.40(AEN) ; port ESS_AEN
ESS_CLK: R70.1 ; port ESS_CLK
ESS_DACK1#: U4.36(DACK1#) ; port ESS_DACK1#
ESS_DRDY: U4.21(DRDY) U66.6 ; port ESS_DRDY
ESS_IRQ1: R29.1 U4.16(IRQ1) ; port ESS_IRQ1
ESS_IRQ2: U4.18(IRQ2) ; port ESS_IRQ2
ESS_Sound: C18.1(+) U4.9(LineOut) ; port ESS_Sound
IOR#: R364.1 U66.3 U66.5 ; port IOR#
KB_Sound: R78.1 ; port KB_Sound
MIC_in_pin: C6.2 J3.4(MI) L13.2(-) ; port MIC_in_pin
MIC_J17: R30.2 ; port MIC_J17
Modem_Audio_Out: R32.1 ; port Modem_Audio_Out
PCMCIA_KB_sound: C25.2(-) R35.1
PCMCIA_Sound: C207.2(-) R120.2 ; port PCMCIA_Sound
PWRGD_shift: C248.1 ; port PWRGD_shift
PWRGD_shift_buff: U71.10 U71.13 ; port PWRGD_shift_buff
SA1: U4.42(A1)
SA2: U4.43(A2)
SA3: U4.45(A3)
SA4: U4.46(A4)
SA5: U4.47(A5)
SA6: U4.48(A6)
SA7: U4.49(A7)
SA8: U4.50(A8)
SA9: U4.51(A9)
SD0: U49.3(A0)
SD1: U49.4(A1)
SD2: U49.5(A2)
SD3: U49.6(A3)
SD4: U49.7(A4)
SD5: U49.8(A5)
SD6: U49.9(A6)
SD7: U49.10(A7)
YMF_CLK: U18.3(C) ; port YMF_CLK
YMF_CS#_Buf: U4.14(DIR) U34.2 U64.12 U66.2 ; port YMF_CS#_Buf
YMF_RD#_Buf: U34.5 U71.12 ; port YMF_RD#_Buf
YMF_SA0_A0: U4.41(A0) U34.12 ; port YMF_SA0_A0
YMF_WR#_Buf: U34.9 U71.9 ; port YMF_WR#_Buf
YMFDAC_OUTPUT: C11.2(-) R26.1
NetC10_1: C10.1(+) C23.1(+) L7.1(+)
NetC10_2: C10.2(-) C23.2(-) C154.2(-) R227.2 U47.1
NetC11_1: C11.1(+) C50.2 R72.1 U11.7
NetC12_1: C12.1(+) U4.1(FoutR)
NetC12_2: C12.2(-) C24.2(-) U4.2(CinR)
NetC13_1: C13.1(+) U48.6(RW)
NetC13_2: C13.2(-) R217.2 R218.2 U47.3(+)
NetC15_1: C15.1(+) C147.2(-) R25.1 U47.7
NetC15_2: C15.2(-) R25.2 R26.2 R32.2 R34.2 R35.2 U47.6(-)
NetC16_1: C16.1 L5.2(-) R24.2
NetC18_2: C18.2(-) R34.1
NetC20_2: C20.2(-) C21.2(-) U4.8(CinL)
NetC21_1: C21.1(+) U4.7(FoutL)
NetC22_1: C22.1(+) U4.10(ByPass)
NetC25_1: C25.1(+) Q6.3(C) R36.2
NetC44_2: C44.2 R69.2 U11.5(+)
NetC52_1: C52.1 R70.2 U4.34(Xin) X2.1
NetC53_2: C53.2 U4.35(Xout) X2.2
NetC54_1: C54.1 U12.2(Bypass) U12.3(IN+)
NetC57_2: C57.2 D12.3(A) U17.5(CD)
NetC85_1: C85.1(+) R24.1 R121.1 U12.4(IN-)
NetC85_2: C85.2(-) J7.2(Pin_2) R121.2 U12.5(OUT+)
NetC97_1: C97.1 D34.1(A) R195.2 U31.2(VDD)
NetC100_1: C100.1 D34.3(A) U31.5(CD)
NetC147_1: C147.1(+) U48.1(RH)
NetC148_2: C148.2 J3.5(MO) L8.2(-)
NetC150_1: C150.1(+) U4.4(MIC)
NetC150_2: C150.2(-) R221.1 R225.1
NetC152_1: C152.1 C155.2 C161.1 R226.1 U4.6(CMR)
NetC153_1: C153.1 R37.2 R217.1
NetC154_1: C154.1(+) R220.1 R227.1 U47.2(-)
NetC157_1: C157.1 C209.1 R256.1 U11.8(V+) U46.1(VDD)
NetC157_2: C157.2 C209.2 R250.2 U11.4(V-) U46.12(GND)
NetC158_2: C158.2 R27.1 R33.1 U47.5(+)
NetC159_2: C159.2 J3.1(SO) L5.1(+)
NetC160_2: C160.2(-) C166.1(+) R224.1 U4.11(ByPass)
NetC162_1: C162.1(+) R222.2 R225.2
NetC164_2: C164.2 R220.2
NetC165_1: C165.1 J3.2(SI) L7.2(-)
NetC207_1: C207.1(+) R71.2
NetC213_1: C213.1 U4.44(VCC_Bus) U49.24(VCCB)
NetC213_2: C213.2 C214.2 R250.1
NetC214_1: C214.1 R75.1 U11.3(+)
NetC248_2: C248.2 D40.3 R247.1 U12.1(~{{SD}})
NetC270_1: C270.1 U64.11
NetC270_2: C270.2 D3.1(A) D3.3(A) R258.2 U49.23(G#)
NetD3_2: D3.2(K) U5.6
NetD5_2: D5.2(K) Q6.2(B) R71.1 R74.1 R78.2
NetJ3_3: J3.3(G) L2.2(-)
NetJ7_1: J7.1(Pin_1) U12.8(OUT-)
NetL8_1: L8.1(+) R30.1
NetL13_1: L13.1(+) R221.2
NetR23_1: R23.1 U4.52(REF)
NetR47_2: R47.2 U4.25(D2) U10.13(D2) U49.20(B2)
NetR48_1: R48.1 U4.31(D6) U10.17(D6) U49.16(B6)
NetR50_2: R50.2 U4.28(D3) U10.14(D3) U49.19(B3)
NetR54_2: R54.2 U4.24(D1) U10.11(D1) U49.21(B1)
NetR55_1: R55.1 U4.30(D5) U10.16(D5) U49.17(B5)
NetR56_1: R56.1 U4.32(D7) U10.18(D7) U49.15(B7)
NetR64_2: R64.2 U4.23(D0) U10.10(D0) U49.22(B0)
NetR65_2: R65.2 U4.29(D4) U10.15(D4) U49.18(B4)
NetR67_1: R67.1 R73.2 U11.1
NetR67_2: R67.2 U11.2(-) U46.16(MP)
NetR69_1: R69.1 U46.2(toBUFF)
NetR72_2: R72.2 U11.6(-)
NetR75_2: R75.2 U46.14(RB)
NetR77_1: R77.1 U10.4(AO) U34.11
NetR92_1: R92.1 U18.8(~{{Q}}) U18.12(D)
NetR92_2: R92.2 U10.24(M)
NetR219_2: R219.2 U49.11(A8)
NetR223_1: R223.1 U49.14(B8)
NetR243_2: R243.2 U10.6(RD#) U34.6
NetR244_2: R244.2 U10.7(CS#) U34.3
NetR245_2: R245.2 U10.5(WR#) U34.8
NetR364_2: R364.2 R370.1 U49.2(DIR)
NetR370_2: R370.2 U66.10
NetU4_37: U4.37(IOR) U71.11
NetU4_38: U4.38(IOW) U71.8
NetU4_39: U4.39(RESET) U20.5
NetU10_20: U10.20(SH) U46.4(LOAD)
NetU10_21: U10.21(MO) U46.7(SD)
NetU10_23: U10.23(SY) U46.10(Clock)
NetU17_1: U17.1(OUT) U20.3
NetU18_2: U18.2(D) U18.6(~{{Q}}) U18.11(C)
NetU66_1: U66.1 U66.8
NetU66_4: U66.4 U66.9

Not connected (* = marked no-connect by the designer): U4 3(NC) 12(NC) 13(GamePad)* 15(NC) 17(NC) 19(NC); U10 2(IRQ#)* 8(NC) 9(NC) 19(NC) 22(NC); U17 4(NC); U18 5(Q)* 9(Q)*; U31 4(NC); U46 3(NC) 5(NC) 6(NC) 8(NC) 9(NC) 11(NC) 13(NC) 15(NC); U48 3(D)*

### Notes on the sheet
- Device_Address_BUS
- (near U49) Device_Data_BUS
- 1
- 2
- 3
- 4
- 5
- 6
- 7
- 8
- 9
- 10
- 11
- A
- B
- C
- D
- E
- F
- G
- H
- Title: PC110
- File: Audio.kicad_sch
- Sheet: /
- Recreated by: Ahmad Byagowi
- KiCad E.D.A.  kicad (5.1.4)-1
- Size: A2
- Date:
- Rev:
- Id: 1/1
- (in symbol YM3014) YM3014B

### Library data of the parts
C6 C9-C16 C18-C25 C44 C50 C52-C54 C57 C62 C68 C85 C97 C100 C147-C155 C157-C162 C164-C166 C203-C205 C207-C209 C211-C215 C248 = C
  C6 C24 C50 C148 C159 C165: Value: DNP; Footprint: Capacitor_SMD:C_0402_1005Metric
  C9 C14 C23 C152 C160-C162 C204 C209 C214: Value: 10uF; Footprint: Capacitor_SMD:C_1206_3216Metric
  C10: Value: DNP; Footprint: Capacitor_SMD:C_1206_3216Metric
  C11 C13 C18 C21 C22 C25: Value: 270nF; Footprint: Capacitor_SMD:C_0603_1608Metric
  C12: Value: 250nF; Footprint: Capacitor_SMD:C_0603_1608Metric
  C15 C85 C208: Value: 1nF; Footprint: Capacitor_SMD:C_0402_1005Metric
  C16 C154: Value: 100pF; Footprint: Capacitor_SMD:C_0402_1005Metric
  C19 C151 C155 C157 C203 C205 C211 C212: Value: 150nF; Footprint: Capacitor_SMD:C_0402_1005Metric
  C20: Value: 1.5nF; Footprint: Capacitor_SMD:C_0402_1005Metric
  C44: Value: 5.6nF; Footprint: Capacitor_SMD:C_0402_1005Metric
  C52 C53: Value: 22pF; Footprint: Capacitor_SMD:C_0402_1005Metric
  C54: Value: 2.7uF; Footprint: Capacitor_SMD:C_0805_2012Metric
  C57: Value: 100nF; Footprint: Capacitor_SMD:C_0603_1608Metric
  C62: Value: 120nF; Footprint: Capacitor_SMD:C_0402_1005Metric
  C68 C97 C149 C213 C215: Value: 100nF; Footprint: Capacitor_SMD:C_0402_1005Metric
  C100 C150: Value: 10nF; Footprint: Capacitor_SMD:C_0603_1608Metric
  C147 C153 C158 C248: Value: 1uF; Footprint: Capacitor_SMD:C_0603_1608Metric
  C164: Value: 330nF; Footprint: Capacitor_SMD:C_0603_1608Metric
  C166 C207: Value: 300nF; Footprint: Capacitor_SMD:C_0603_1608Metric
C270 R23-R30 R32-R37 R47 R48 R50 R54-R56 R64 R65 R67 R69-R75 R77 R78 R88 R92 R120 R121 R147 R195 R217-R227 R243-R245 R247 R250 R256 R258 R364 R370 = R
  C270: Value: DNP; Footprint: Capacitor_SMD:C_0402_1005Metric
  R23 R30 R67 R72 R75 R88 R195 R221: Value: 0; Footprint: PCM_Resistor_SMD_AKL:R_0402_1005Metric
  R24: Value: 4.7k; Footprint: PCM_Resistor_SMD_AKL:R_0402_1005Metric
  R25 R29 R34: Value: 1k; Footprint: PCM_Resistor_SMD_AKL:R_0402_1005Metric
  R26 R32 R69 R73: Value: 2.2k; Footprint: PCM_Resistor_SMD_AKL:R_0402_1005Metric
  R27 R33 R77 R147 R217 R218 R224: Value: 470k; Footprint: PCM_Resistor_SMD_AKL:R_0402_1005Metric
  R28: Value: 56; Footprint: PCM_Resistor_SMD_AKL:R_1206_3216Metric
  R35 R37 R120 R121 R219 R223: Value: 100k; Footprint: PCM_Resistor_SMD_AKL:R_0402_1005Metric
  R36 R71 R74 R78 R220 R227 R258: Value: 10k; Footprint: PCM_Resistor_SMD_AKL:R_0402_1005Metric
  R47 R48 R50 R54-R56 R64 R65 R70: Value: DNP; Footprint: PCM_Resistor_SMD_AKL:R_0402_1005Metric
  R92: Value: 47; Footprint: PCM_Resistor_SMD_AKL:R_0402_1005Metric
  R222 R225: Value: 6.8k; Footprint: PCM_Resistor_SMD_AKL:R_0402_1005Metric
  R226: Value: 120; Footprint: PCM_Resistor_SMD_AKL:R_1206_3216Metric
  R243-R245 R247: Value: 470k; Footprint: Resistor_SMD:R_0402_1005Metric
  R250: Value: 0; Footprint: PCM_Resistor_SMD_AKL:R_0805_2012Metric
  R256: Value: 100; Footprint: PCM_Resistor_SMD_AKL:R_0805_2012Metric
  R364: Value: DNP; Footprint: Resistor_SMD:R_0402_1005Metric
  R370: Value: 0; Footprint: Resistor_SMD:R_0402_1005Metric
D3 D5 D12 D34 = D_Schottky_Dual_CommonCathode_AKA: Footprint: PC110:3D
  D3 D5: Value: 3D
  D12 D34: Value: DNP
D40 = 3D_Diode: Value: N; Footprint: PC110:SOT-416L
J3 = Audio_Jack: Value: Audio-Jack; Footprint: PC110:Audio-Jack
J7 = Conn_01x02: Value: SPKR; Footprint: PC110:SPKR
L2 L5 L7 L8 L13 = L: Value: 1.5uH; Footprint: Inductor_SMD:L_0603_1608Metric
Q6 = Q_NPN_Generic_EBC: Value: ST3; Footprint: PC110:SOT-416L
U4 = ES488: Value: ES488F; Footprint: PC110:QFN-52
U5 = 74LS14: Value: 74HC14; Footprint: Package_SO:TSSOP-14_4.4x5mm_P0.65mm
U11 = LM2904: Value: NJM2904M; Footprint: PC110:soic-8-small
U17 = QC01_1: Value: 3E00; Footprint: Package_TO_SOT_SMD:SOT-23-5
U18 = 74HC74: Value: VT74; Footprint: Package_SO:TSSOP-14_4.4x5mm_P0.65mm
U20 = 74LVC3G14: Value: 7W14; Footprint: PC110:sso-8
U31 = QC01: Value: 3F01; Footprint: Package_TO_SOT_SMD:SOT-23-5
U34 U64 = 74LS126: Footprint: Package_SO:TSSOP-14_4.4x5mm_P0.65mm
  U34: Value: 74LV126
  U64: Value: SN74LV126
U46 = YM3014: Value: Y3014; Footprint: PC110:SOP-16
U47 = Opamp_Dual: Value: 3414A; Footprint: PC110:SOIC-8
U66 = 74LS02: Value: SN74LV02; Footprint: Package_SO:TSSOP-14_4.4x5mm_P0.65mm
U71 = 74LS32: Value: SN74LV32; Footprint: Package_SO:TSSOP-14_4.4x5mm_P0.65mm
X2 = Crystal_GND3: Value: 89G6821; Footprint: PC110:XTAL-1
U10 = YM3812: Value: YM3812; Footprint: PC110:SOP-24
U12 = LM4861: Value: LM4861; Footprint: PC110:SOIC-8-narrow
U48 = DS1669: Value: DS1669; Footprint: PC110:SOIC-8
U49 = HD151015: Value: HD151015; Footprint: Package_SO:SSOP-24_5.3x8.2mm_P0.65mm

## Sheet ROM.SchDoc
size 420 x 297 mm
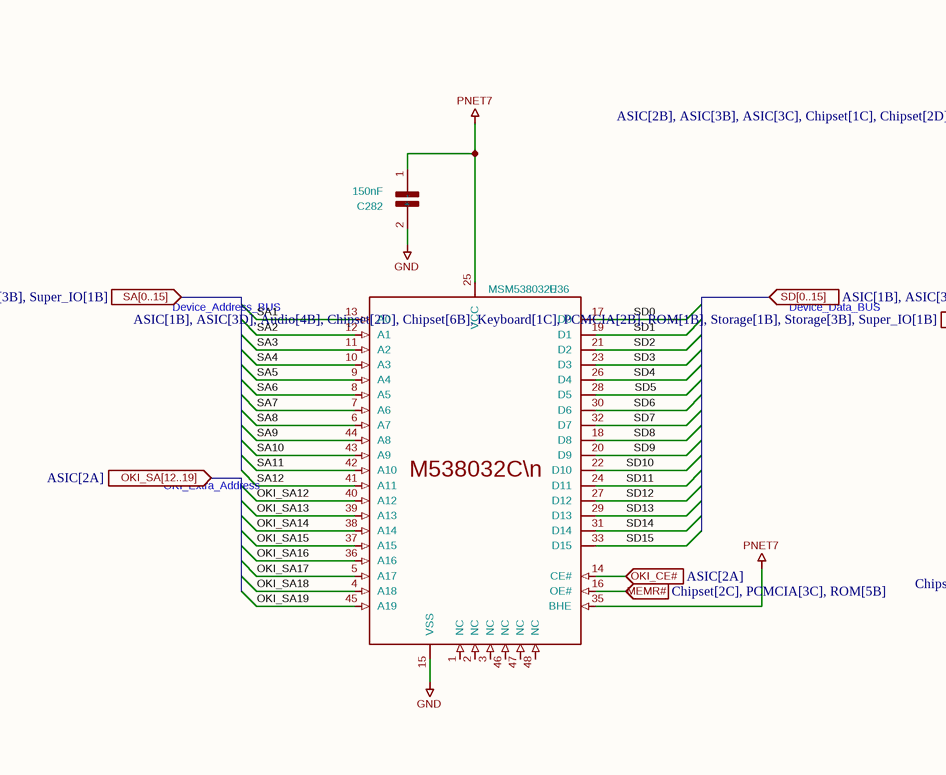
[diagram p44: ROM.SchDoc, left]
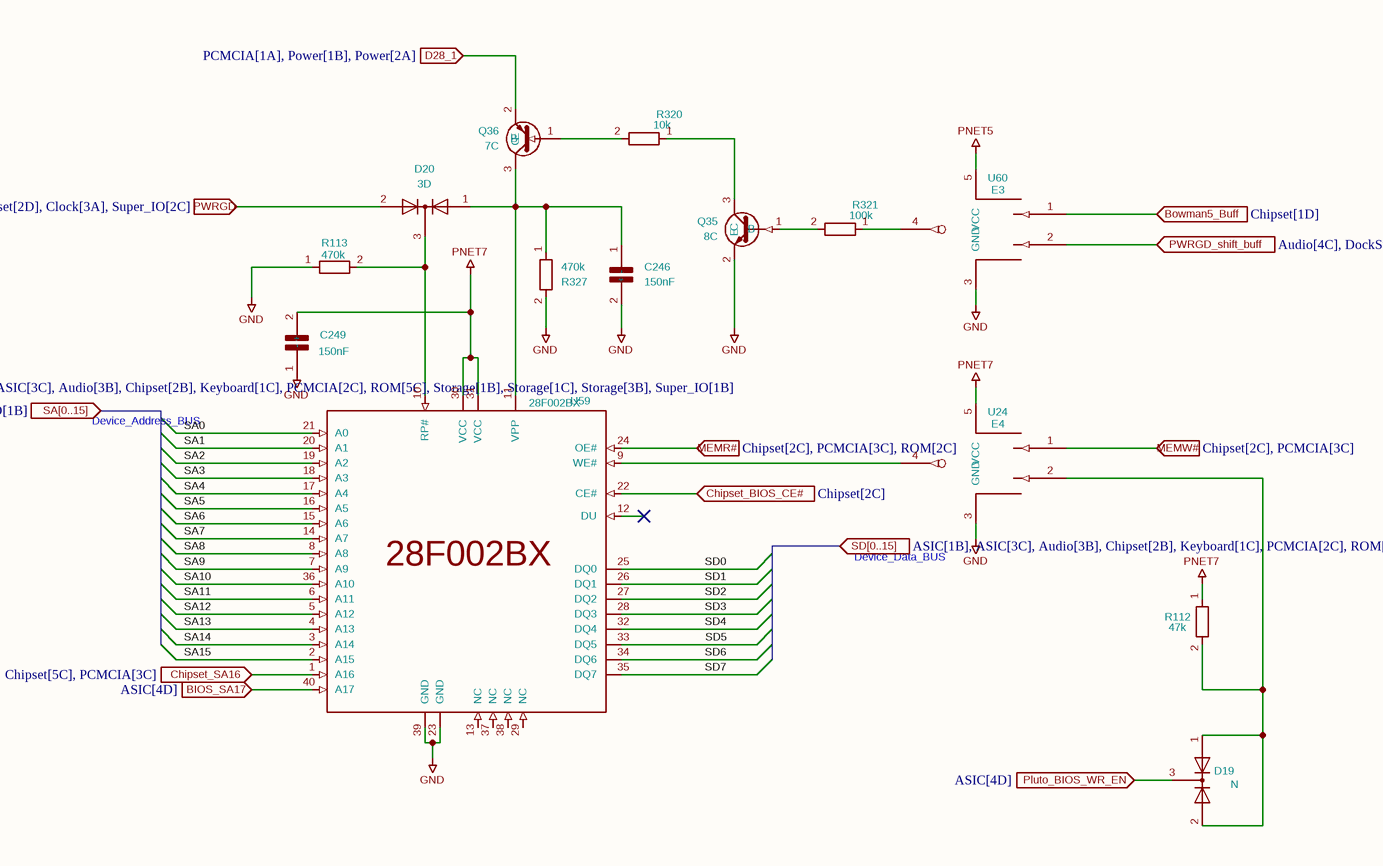
[diagram p45: ROM.SchDoc, right]

### Parts
C246  150nF  [C_0603_1608Metric]
C249  150nF  [C_0402_1005Metric]
C282  150nF  [C_0402_1005Metric]
D19  N  [SOT-416L]
D20  3D  [SOT-416L]
Q35  8C  [SOT-523]
Q36  7C  [TSOT-23]
R112  47k  [R_0402_1005Metric]
R113  470k  [R_0402_1005Metric]
R320  10k  [R_0402_1005Metric]
R321  100k  [R_0402_1005Metric]
R327  470k  [R_0402_1005Metric]
U24  E4  [SOT-353]
U36  MSM538032E  [SOP48]
U59  28F002BX  [Flash-40]
U60  E3  [SOT-353]

### Ports
BIOS_SA17 (in, see ASIC[4D]), Bowman5_Buff (in, see Chipset[1D]), Chipset_BIOS_CE# (in, see Chipset[2C]), Chipset_SA16 (in, see Chipset[5C], PCMCIA[3C]), D28_1 (in, see PCMCIA[1A], Power[1B], Power[2A]), MEMR# (in, see Chipset[2C], PCMCIA[3C], ROM[2C]), MEMR# (in, see Chipset[2C], PCMCIA[3C], ROM[5B]), MEMW# (in, see Chipset[2C], PCMCIA[3C]), OKI_CE# (in, see ASIC[2A]), OKI_SA[12..19] (in, see ASIC[2A]), Pluto_BIOS_WR_EN (in, see ASIC[4D]), PWRGD (in, see ASIC[2B], ASIC[3B], ASIC[3C], Chipset[1C], Chipset[2D], Clock[3A], Super_IO[2C]), PWRGD_shift_buff (in, see Audio[4C], DockStation[5B], Power[2C], Power[5C]), SA[0..15] (in, see ASIC[1B], ASIC[3D], Audio[4B], Chipset[2D], Chipset[6B], Keyboard[1C], PCMCIA[2B], ROM[1B], Storage[1B], Storage[3B], Super_IO[1B]), SA[0..15] (in, see ASIC[1B], ASIC[3D], Audio[4B], Chipset[2D], Chipset[6B], Keyboard[1C], PCMCIA[2B], ROM[3B], Storage[1B], Storage[3B], Super_IO[1B]), SD[0..15] (in, see ASIC[1B], ASIC[3C], Audio[3B], Chipset[2B], Keyboard[1C], PCMCIA[2C], ROM[3B], Storage[1B], Storage[1C], Storage[3B], Super_IO[1B]), SD[0..15] (in, see ASIC[1B], ASIC[3C], Audio[3B], Chipset[2B], Keyboard[1C], PCMCIA[2C], ROM[5C], Storage[1B], Storage[1C], Storage[3B], Super_IO[1B])

### Nets
GND: C246.2(-) C249.1(+) C282.2(-) Q35.2(E) R113.1 R327.2 U24.3(GND) U36.15(VSS) U59.23(GND) U59.39(GND) U60.3(GND)
PNET5: U60.5(VCC)
PNET7: C249.2(-) C282.1(+) R112.1 U24.5(VCC) U36.25(VCC) U36.35(BHE) U59.30(VCC) U59.31(VCC)
BIOS_SA17: U59.40(A17) ; port BIOS_SA17
Bowman5_Buff: U60.1 ; port Bowman5_Buff
Chipset_BIOS_CE#: U59.22(CE#) ; port Chipset_BIOS_CE#
Chipset_SA16: U59.1(A16) ; port Chipset_SA16
D28_1: Q36.2(E) ; port D28_1
MEMR#: U36.16(OE#) U59.24(OE#) ; port MEMR#
MEMW#: U24.1 ; port MEMW#
OKI_CE#: U36.14(CE#) ; port OKI_CE#
OKI_SA12: U36.40(A12)
OKI_SA13: U36.39(A13)
OKI_SA14: U36.38(A14)
OKI_SA15: U36.37(A15)
OKI_SA16: U36.36(A16)
OKI_SA17: U36.5(A17)
OKI_SA18: U36.4(A18)
OKI_SA19: U36.45(A19)
Pluto_BIOS_WR_EN: D19.3 ; port Pluto_BIOS_WR_EN
PWRGD: D20.2 ; port PWRGD
PWRGD_shift_buff: U60.2 ; port PWRGD_shift_buff
SA0: U59.21(A0)
SA1: U36.13(A0) U59.20(A1)
SA2: U36.12(A1) U59.19(A2)
SA3: U36.11(A2) U59.18(A3)
SA4: U36.10(A3) U59.17(A4)
SA5: U36.9(A4) U59.16(A5)
SA6: U36.8(A5) U59.15(A6)
SA7: U36.7(A6) U59.14(A7)
SA8: U36.6(A7) U59.8(A8)
SA9: U36.44(A8) U59.7(A9)
SA10: U36.43(A9) U59.36(A10)
SA11: U36.42(A10) U59.6(A11)
SA12: U36.41(A11) U59.5(A12)
SA13: U59.4(A13)
SA14: U59.3(A14)
SA15: U59.2(A15)
SD0: U36.17(D0) U59.25(DQ0)
SD1: U36.19(D1) U59.26(DQ1)
SD2: U36.21(D2) U59.27(DQ2)
SD3: U36.23(D3) U59.28(DQ3)
SD4: U36.26(D4) U59.32(DQ4)
SD5: U36.28(D5) U59.33(DQ5)
SD6: U36.30(D6) U59.34(DQ6)
SD7: U36.32(D7) U59.35(DQ7)
SD8: U36.18(D8)
SD9: U36.20(D9)
SD10: U36.22(D10)
SD11: U36.24(D11)
SD12: U36.27(D12)
SD13: U36.29(D13)
SD14: U36.31(D14)
SD15: U36.33(D15)
NetC246_1: C246.1(+) D20.1 Q36.3(C) R327.1 U59.11(VPP)
NetD19_1: D19.1 D19.2 R112.2 U24.2
NetD20_3: D20.3 R113.2 U59.10(RP#)
NetQ35_1: Q35.1(B) R321.2
NetQ35_3: Q35.3(C) R320.1
NetQ36_1: Q36.1(B) R320.2
NetR321_1: R321.1 U60.4
NetU24_4: U24.4 U59.9(WE#)

Not connected (* = marked no-connect by the designer): U36 1(NC) 2(NC) 3(NC) 46(NC) 47(NC) 48(NC); U59 12(DU)* 13(NC) 29(NC) 37(NC) 38(NC)

### Notes on the sheet
- Device_Address_BUS
- Device_Data_BUS
- OKI_Extra_Address
- (near U24) Device_Data_BUS
- 1
- 2
- 3
- 4
- 5
- 6
- 7
- 8
- A
- B
- C
- D
- E
- Title:
- File: ROM.kicad_sch
- Sheet: /
- Recreated by: Ahmad Byagowi
- F
- KiCad E.D.A.  kicad (5.1.4)-1
- Size: A3
- Date:
- Rev:
- Id: 1/1
- (in symbol M538032C) M538032C\n

### Library data of the parts
C246 C249 C282 = C: Value: 150nF
  C246: Footprint: Capacitor_SMD:C_0603_1608Metric
  C249 C282: Footprint: Capacitor_SMD:C_0402_1005Metric
D19 D20 = 3D_Diode: Footprint: PC110:SOT-416L
  D19: Value: N
  D20: Value: 3D
Q35 = MMBTA44: Value: 8C; Footprint: Package_TO_SOT_SMD:SOT-523
Q36 = Q_PNP_Generic_BEC: Value: 7C; Footprint: Package_TO_SOT_SMD:TSOT-23
R112 R113 R320 R321 R327 = R: Footprint: PCM_Resistor_SMD_AKL:R_0402_1005Metric
  R112: Value: 47k
  R113 R327: Value: 470k
  R320: Value: 10k
  R321: Value: 100k
U24 U60 = 74AUP1G02: Footprint: PC110:SOT-353
  U24: Value: E4
  U60: Value: E3
U36 = M538032C: Value: MSM538032E; Footprint: PC110:SOP48
U59 = 28F002BX: Value: 28F002BX; Footprint: PC110:Flash-40